# EAGLE board DLT_Jetson_Nano (EAGLE 9.4.2)
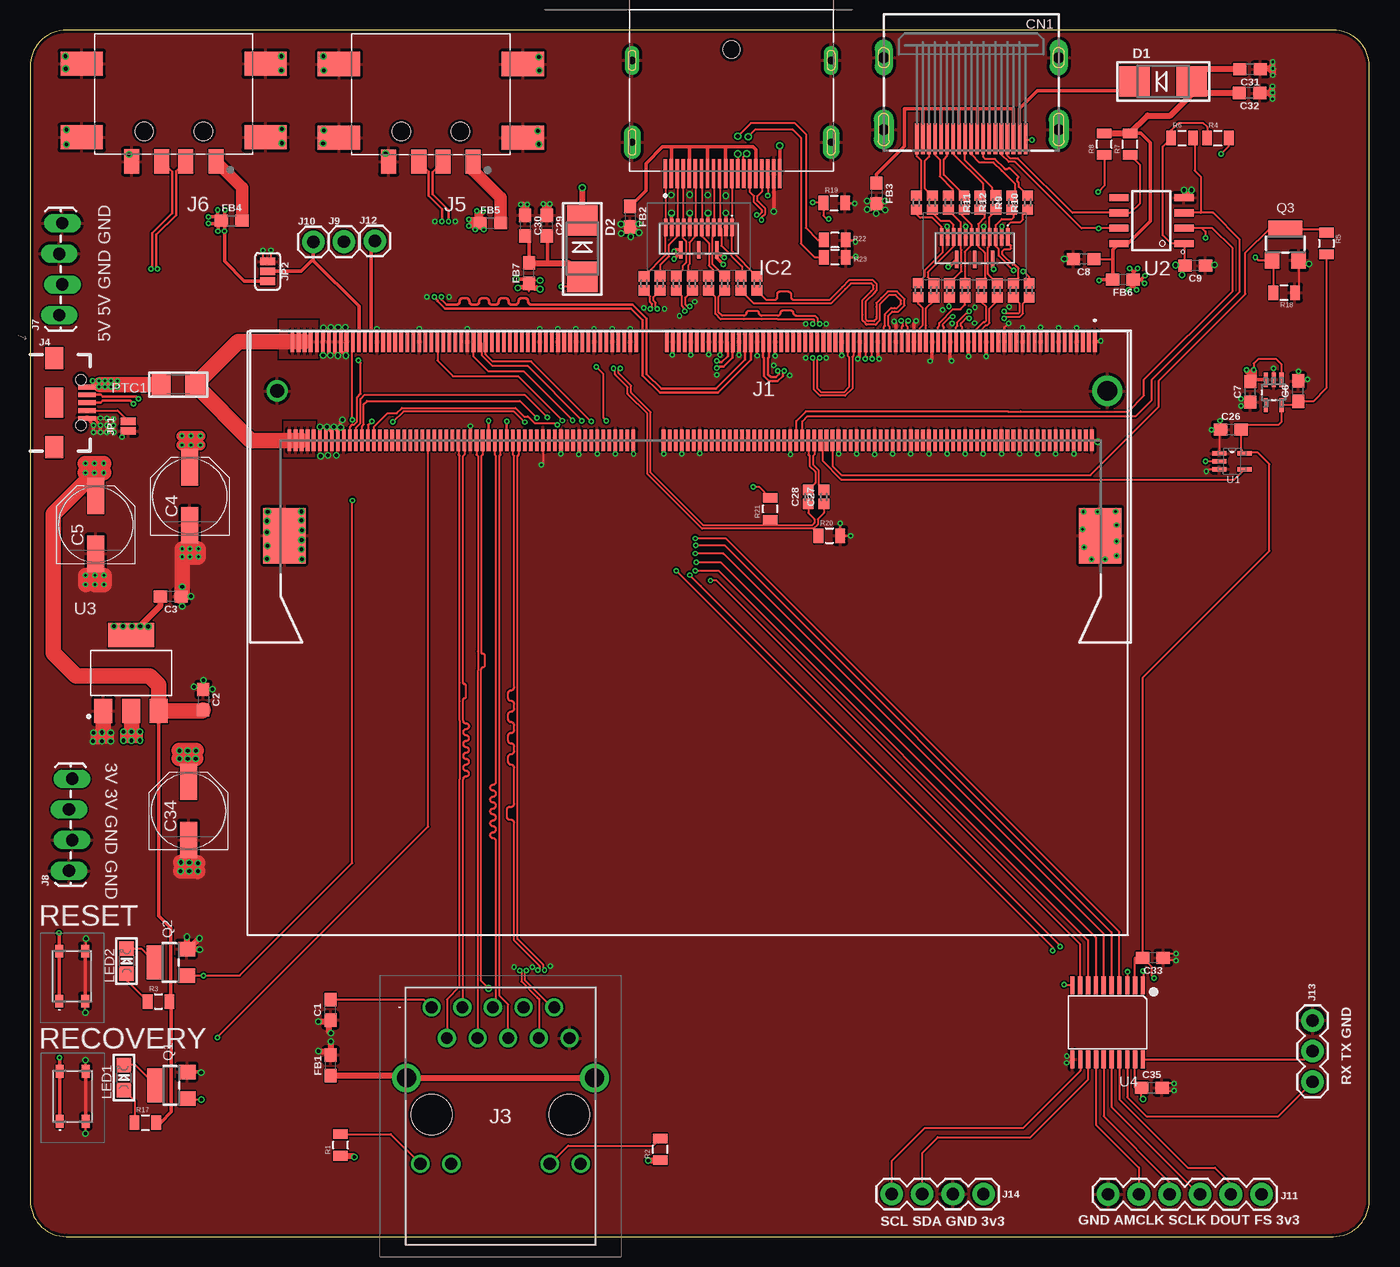
[diagram p2: board, top side]
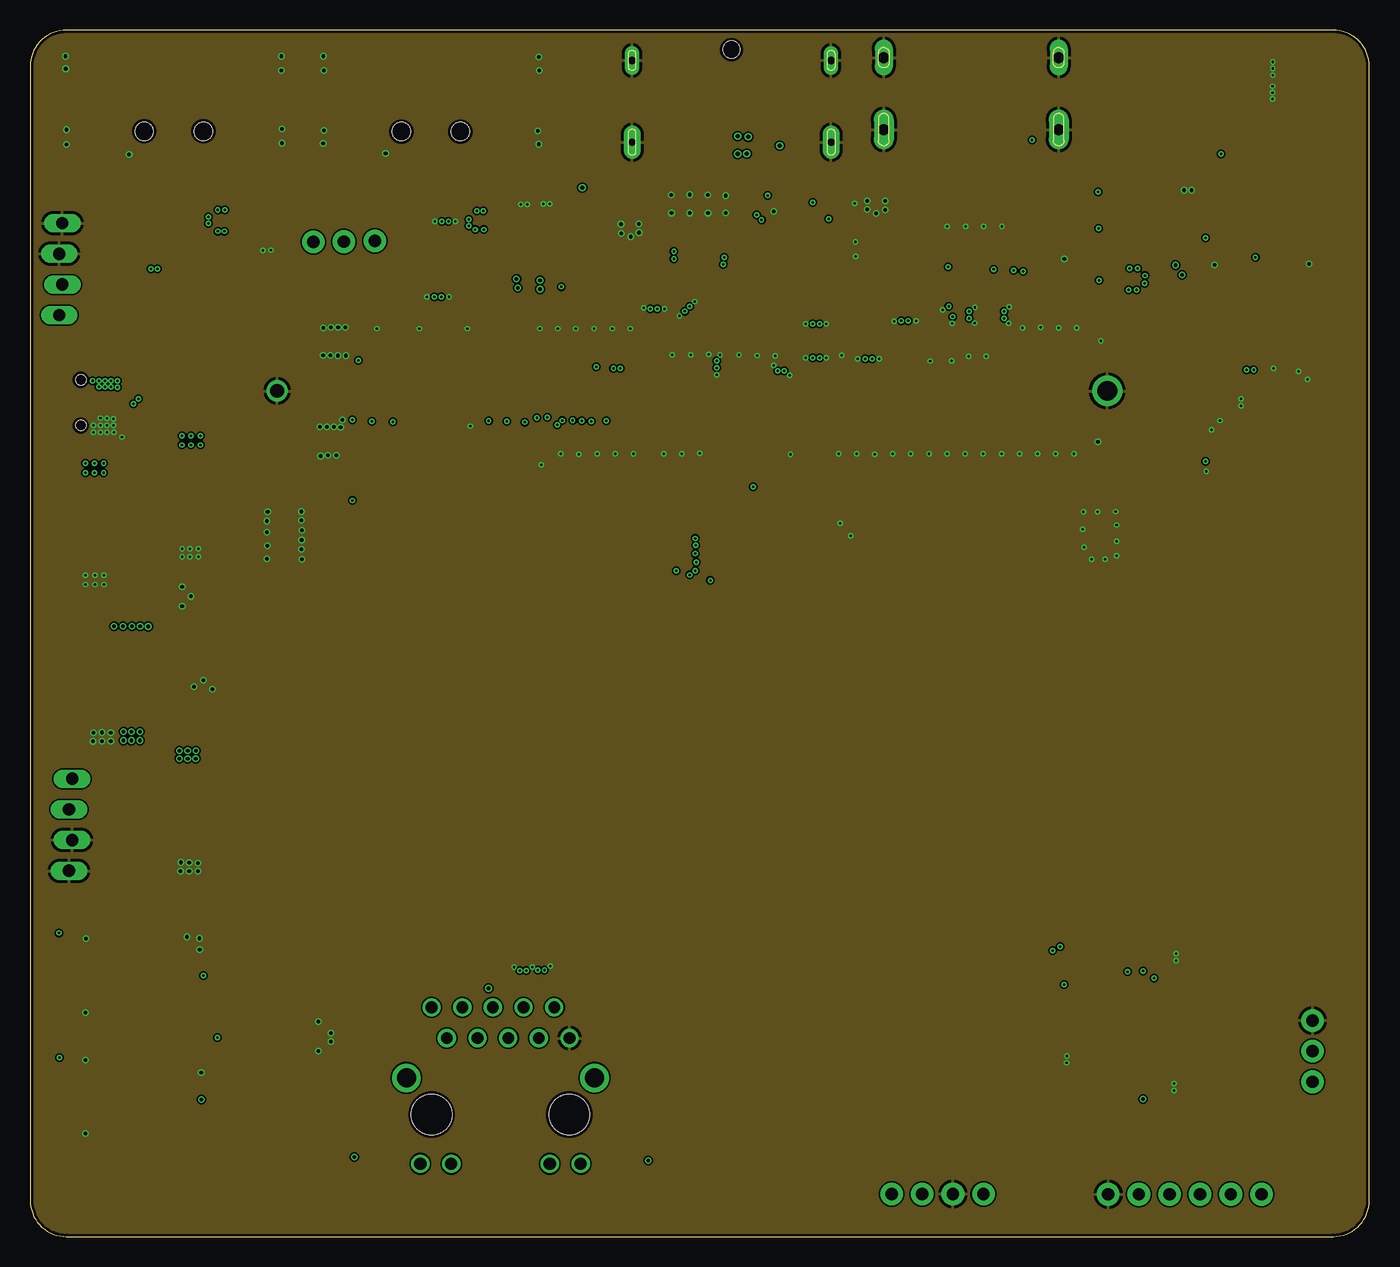
[diagram p3: board, inner layer Route2]
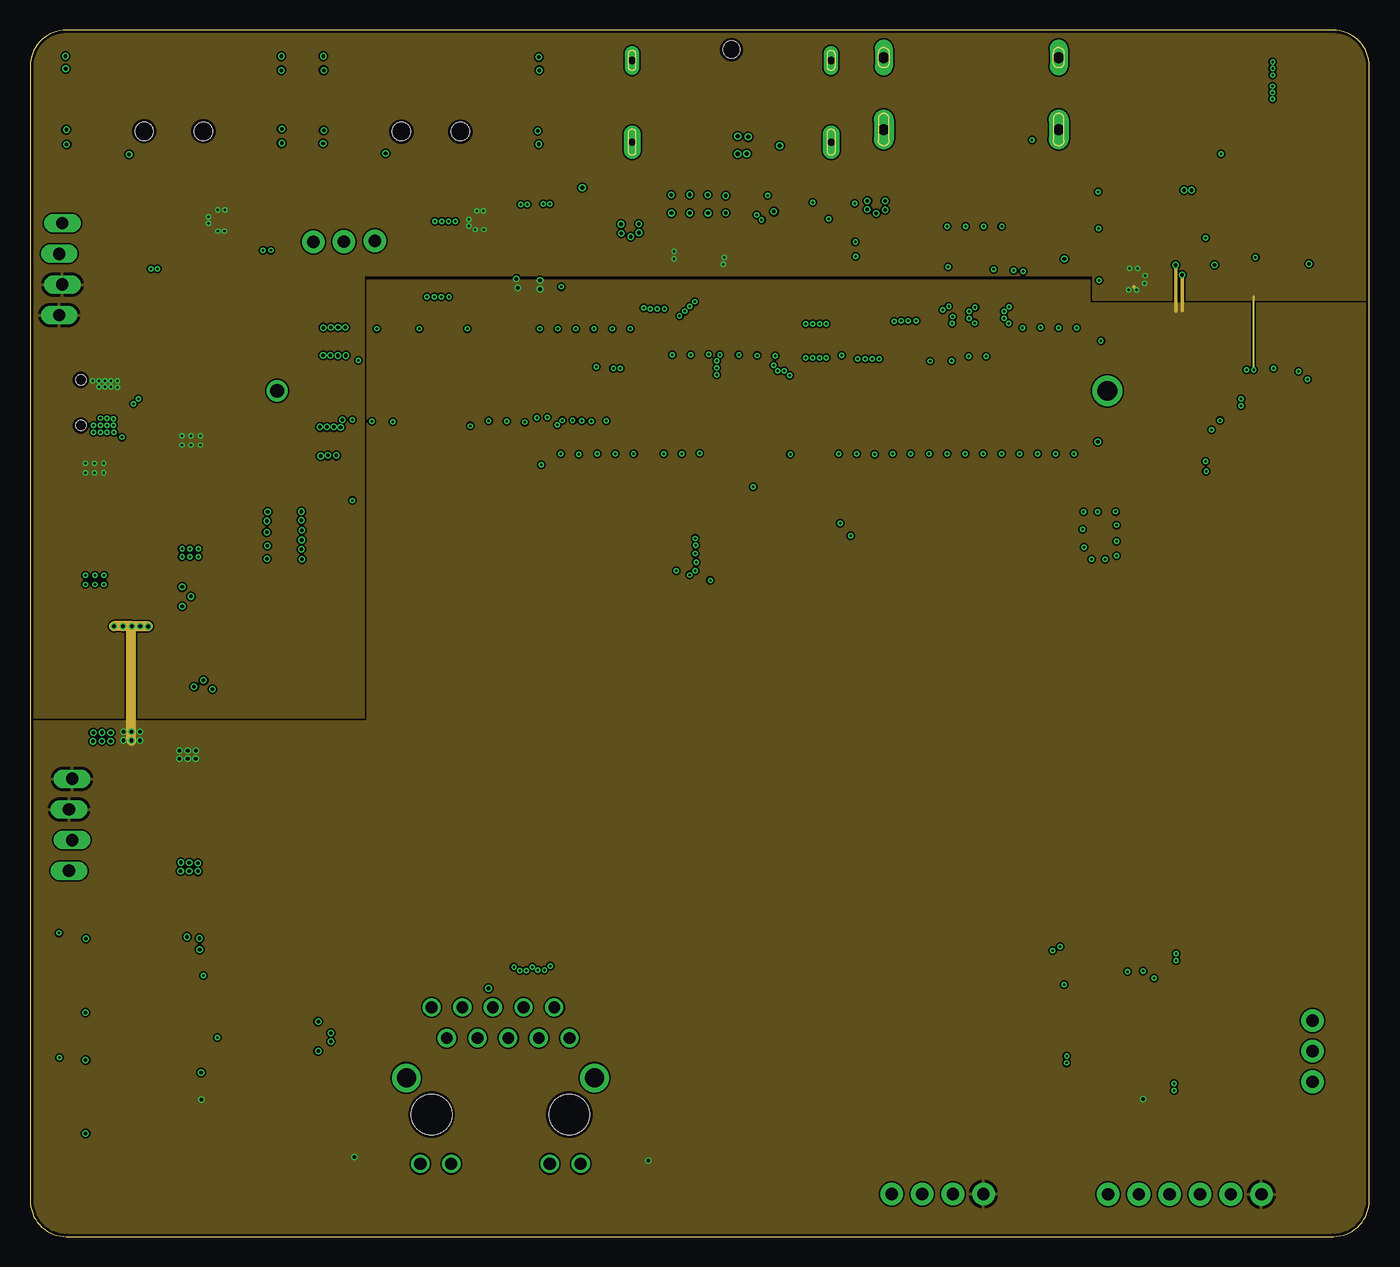
[diagram p4: board, inner layer Route15]
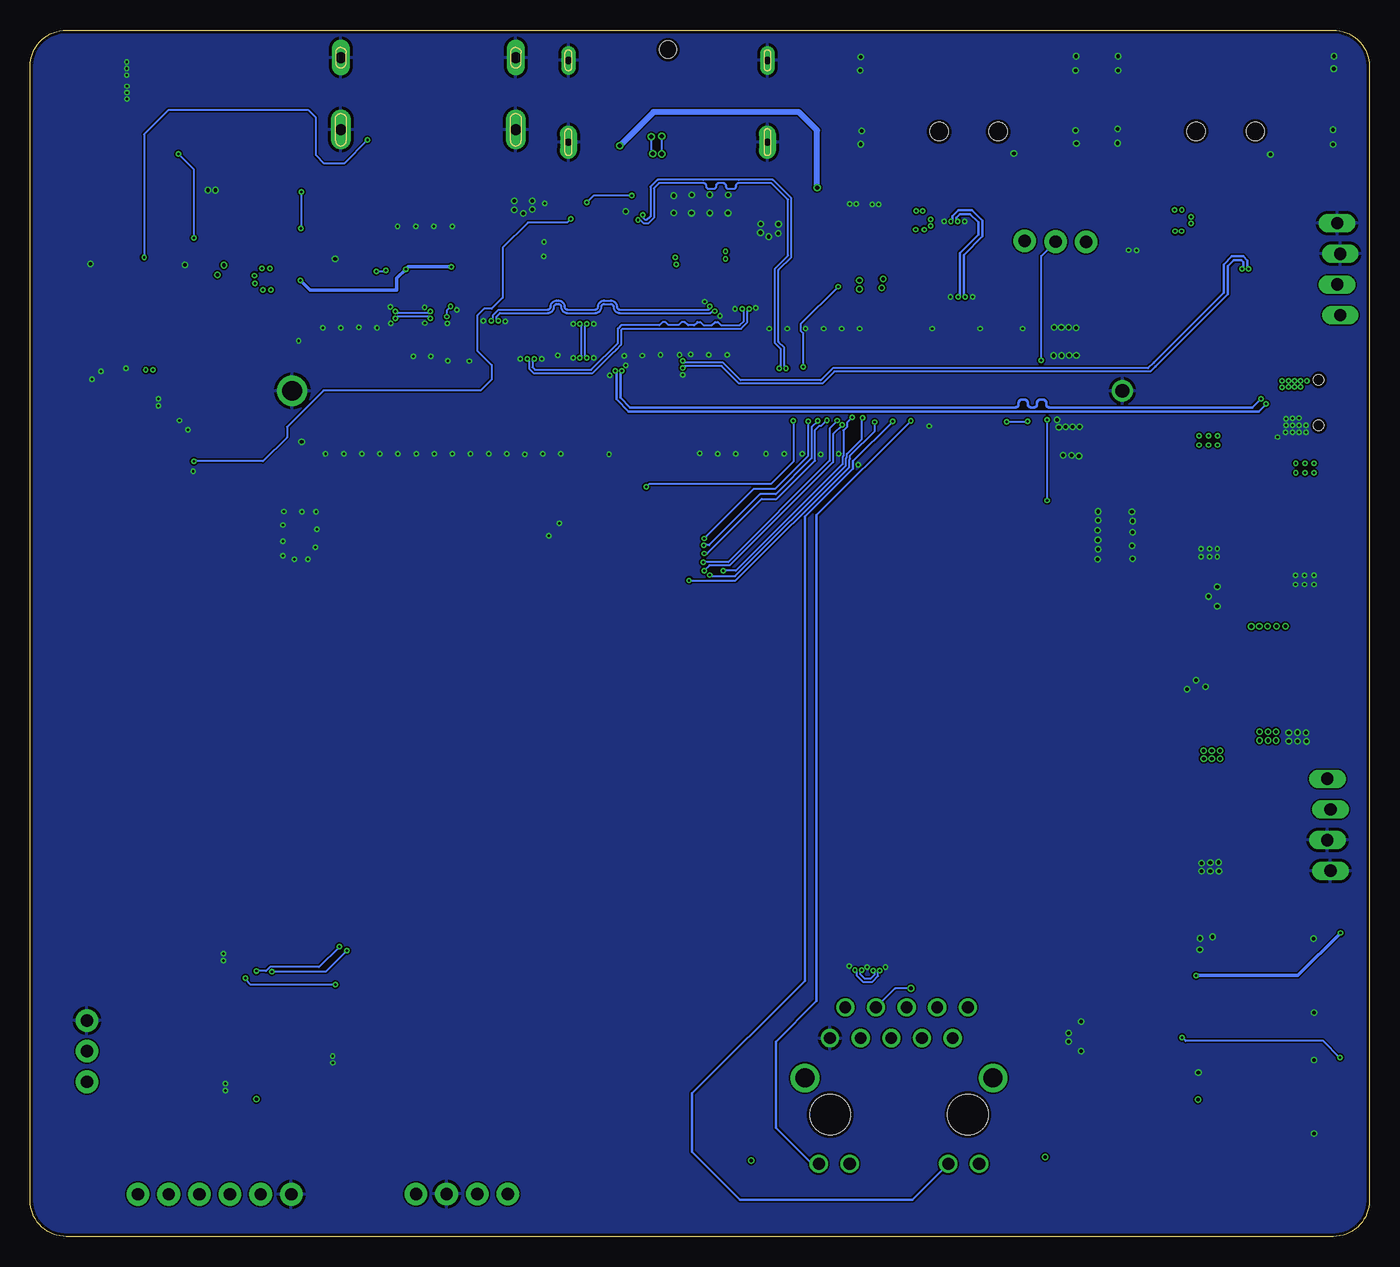
[diagram p5: board, bottom side, seen from below]

Size 111 x 100 mm. Coordinates in mm from the lower left corner, seen from the top.
Outline: 108,100 3,100 arc90 0,97 0,3 arc90 3,0 108,0 arc90 111,3 111,97 arc90 108,100
Copper layers (1+2*15+16): Top 0.035mm / dielectric 0.2mm / Route2 0.0175mm / dielectric 0.265mm / Route15 0.0175mm / dielectric 0.2mm / Bottom 0.035mm
Design rules "DLT-4Layer": minimum track width 6mil, minimum drill 0.2mm, track to track 5mil, track to pad 4mil, pad to pad 4mil, via to via 4mil, smd to smd 0mil, copper to edge 10mil, drill to drill 10mil, minimum pad ring 10mil, minimum via ring 0.125mm, stop-mask expansion 2mil, vias tented up to drill 100mil, thermal gap 10mil

## Footprints (pad centres in the part's own frame; a part is rotated, then mirrored left to right if it is on the bottom)
0603 = smd 1.1 x 1: 1 -0.85,0; 2 0.85,0
PANASONIC_D = smd 3 x 1.4: + 2.4,0; - -2.4,0
0402 = smd 0.85 x 0.9: 1 -0.58,0; 2 0.58,0
HDMI_MOLEX_47151-0001 = smd 0.3 x 2.6: 1 4.5,0; 2 4,0; 3 3.5,0; 4 3,0; 5 2.5,0; 6 2,0; 7 1.5,0; 8 1,0; 9 0.5,0; 10 0,0; 11 -0.5,0; 12 -1,0; 13 -1.5,0; 14 -2,0; 15 -2.5,0; 16 -3,0; 17 -3.5,0; 18 -4,0; 19 -4.5,0 | drill 0.9 pad 1.65 long: P$1 -7.25,-0.76; P$2 7.25,-0.76 | drill 0.9 pad 1.5 long: P$3 7.25,-6.72; P$4 -7.25,-6.72
SMADIODE = smd 2.54 x 2.54: A 2.349,0; C -2.349,0
TPD8S009DSMR = smd 0.3 x 1.45: 1 2.75,0.775; 2 2.25,0.775; 3 1.75,0.775; 4 1.25,0.775; 5 0.75,0.775; 6 0.25,0.775; 7 -0.25,0.775; 8 -0.75,0.775; 9 -1.25,0.775; 10 -1.75,0.775; 11 -2.25,0.775; 12 -2.75,0.775; 13 -1.5,-1.075; 14 0,-1.075; 15 1.5,-1.075
SOT65P210X110-5N = smd 1.168 x 0.356: 1 -1.041,0.66; 2 -1.041,0; 3 -1.041,-0.66; 4 1.041,-0.66; 5 1.041,0.66
2309409-1 = smd 0.3 x 1.75: 1 38.25,8.2; 2 38,0; 3 37.75,8.2; 4 37.5,0; 5 37.25,8.2; 6 37,0; 7 36.75,8.2; 8 36.5,0; 9 36.25,8.2; 10 36,0; 11 35.75,8.2; 12 35.5,0; 13 35.25,8.2; 14 35,0; 15 34.75,8.2; 16 34.5,0; 17 34.25,8.2; 18 34,0; 19 33.75,8.2; 20 33.5,0; 21 33.25,8.2; 22 33,0; 23 32.75,8.2; 24 32.5,0; 25 32.25,8.2; 26 32,0; 27 31.75,8.2; 28 31.5,0; 29 31.25,8.2; 30 31,0; 31 30.75,8.2; 32 30.5,0; 33 30.25,8.2; 34 30,0; 35 29.75,8.2; 36 29.5,0; 37 29.25,8.2; 38 29,0; 39 28.75,8.2; 40 28.5,0; 41 28.25,8.2; 42 28,0; 43 27.75,8.2; 44 27.5,0; 45 27.25,8.2; 46 27,0; 47 26.75,8.2; 48 26.5,0; 49 26.25,8.2; 50 26,0; 51 25.75,8.2; 52 25.5,0; 53 25.25,8.2; 54 25,0; 55 24.75,8.2; 56 24.5,0; 57 24.25,8.2; 58 24,0; 59 23.75,8.2; 60 23.5,0; 61 23.25,8.2; 62 23,0; 63 22.75,8.2; 64 22.5,0; 65 22.25,8.2; 66 22,0; 67 21.75,8.2; 68 21.5,0; 69 21.25,8.2; 70 21,0; 71 20.75,8.2; 72 20.5,0; 73 20.25,8.2; 74 20,0; 75 19.75,8.2; 76 19.5,0; 77 19.25,8.2; 78 19,0; 79 18.75,8.2; 80 18.5,0; 81 18.25,8.2; 82 18,0; 83 17.75,8.2; 84 17.5,0; 85 17.25,8.2; 86 17,0; 87 16.75,8.2; 88 16.5,0; 89 16.25,8.2; 90 16,0; 91 15.75,8.2; 92 15.5,0; 93 15.25,8.2; 94 15,0; 95 14.75,8.2; 96 14.5,0; 97 14.25,8.2; 98 14,0; 99 13.75,8.2; 100 13.5,0; 101 13.25,8.2; 102 13,0; 103 12.75,8.2; 104 12.5,0; 105 12.25,8.2; 106 12,0; 107 11.75,8.2; 108 11.5,0; 109 11.25,8.2; 110 11,0; 111 10.75,8.2; 112 10.5,0; 113 10.25,8.2; 114 10,0; 115 9.75,8.2; 116 9.5,0; 117 9.25,8.2; 118 9,0; 119 8.75,8.2; 120 8.5,0; 121 8.25,8.2; 122 8,0; 123 7.75,8.2; 124 7.5,0; 125 7.25,8.2; 126 7,0; 127 6.75,8.2; 128 6.5,0; 129 6.25,8.2; 130 6,0; 131 5.75,8.2; 132 5.5,0; 133 5.25,8.2; 134 5,0; 135 4.75,8.2; 136 4.5,0; 137 4.25,8.2; 138 4,0; 139 3.75,8.2; 140 3.5,0; 141 3.25,8.2; 142 3,0; 143 2.75,8.2; 144 2.5,0; 145 0.25,8.2; 146 0,0; 147 -0.25,8.2; 148 -0.5,0; 149 -0.75,8.2; 150 -1,0; 151 -1.25,8.2; 152 -1.5,0; 153 -1.75,8.2; 154 -2,0; 155 -2.25,8.2; 156 -2.5,0; 157 -2.75,8.2; 158 -3,0; 159 -3.25,8.2; 160 -3.5,0; 161 -3.75,8.2; 162 -4,0; 163 -4.25,8.2; 164 -4.5,0; 165 -4.75,8.2; 166 -5,0; 167 -5.25,8.2; 168 -5.5,0; 169 -5.75,8.2; 170 -6,0; 171 -6.25,8.2; 172 -6.5,0; 173 -6.75,8.2; 174 -7,0; 175 -7.25,8.2; 176 -7.5,0; 177 -7.75,8.2; 178 -8,0; 179 -8.25,8.2; 180 -8.5,0; 181 -8.75,8.2; 182 -9,0; 183 -9.25,8.2; 184 -9.5,0; 185 -9.75,8.2; 186 -10,0; 187 -10.25,8.2; 188 -10.5,0; 189 -10.75,8.2; 190 -11,0; 191 -11.25,8.2; 192 -11.5,0; 193 -11.75,8.2; 194 -12,0; 195 -12.25,8.2; 196 -12.5,0; 197 -12.75,8.2; 198 -13,0; 199 -13.25,8.2; 200 -13.5,0; 201 -13.75,8.2; 202 -14,0; 203 -14.25,8.2; 204 -14.5,0; 205 -14.75,8.2; 206 -15,0; 207 -15.25,8.2; 208 -15.5,0; 209 -15.75,8.2; 210 -16,0; 211 -16.25,8.2; 212 -16.5,0; 213 -16.75,8.2; 214 -17,0; 215 -17.25,8.2; 216 -17.5,0; 217 -17.75,8.2; 218 -18,0; 219 -18.25,8.2; 220 -18.5,0; 221 -18.75,8.2; 222 -19,0; 223 -19.25,8.2; 224 -19.5,0; 225 -19.75,8.2; 226 -20,0; 227 -20.25,8.2; 228 -20.5,0; 229 -20.75,8.2; 230 -21,0; 231 -21.25,8.2; 232 -21.5,0; 233 -21.75,8.2; 234 -22,0; 235 -22.25,8.2; 236 -22.5,0; 237 -22.75,8.2; 238 -23,0; 239 -23.25,8.2; 240 -23.5,0; 241 -23.75,8.2; 242 -24,0; 243 -24.25,8.2; 244 -24.5,0; 245 -24.75,8.2; 246 -25,0; 247 -25.25,8.2; 248 -25.5,0; 249 -25.75,8.2; 250 -26,0; 251 -26.25,8.2; 252 -26.5,0; 253 -26.75,8.2; 254 -27,0; 255 -27.25,8.2; 256 -27.5,0; 257 -27.75,8.2; 258 -28,0; 259 -28.25,8.2; 260 -28.5,0 | drill 1.65 pad 2.5: 261 39.275,4.1 | drill 1.15 pad 1.75: 262 -29.525,4.1 | smd 3.5 x 4.6: 263 38.675,-7.9; 264 -28.925,-7.9
MOLEX_47272-0001 = smd 0.28 x 2.4: 1 5.5,13.56; 2 5,13.56; 3 4.5,13.56; 4 4,13.56; 5 3.5,13.56; 6 3,13.56; 7 2.5,13.56; 8 2,13.56; 9 1.5,13.56; 10 1,13.56; 11 0.5,13.56; 12 0,13.56; 13 -0.5,13.56; 14 -1,13.56; 15 -1.5,13.56; 16 -2,13.56; 17 -2.5,13.56; 18 -3,13.56; 19 -3.5,13.56; 20 -4,13.56 | drill 0.6 pad 1.4 long: S1 -8.25,10.96; S2 8.25,10.96 | drill 0.6 pad 1.2 long: S3 -8.25,4.18; S4 8.25,4.18 | hole 1.4: 0,3.28
936263508 = drill 0.97 pad 1.509: 1 0,0; 2 1.27,-2.54; 3 2.54,0; 4 3.81,-2.54; 5 5.08,0; 6 6.35,-2.54; 7 7.62,0; 8 8.89,-2.54; 9 10.16,0; 10 11.43,-2.54 | drill 1.02 pad 1.53: 11 -0.92,-12.96; 12 1.62,-12.96; 13 9.81,-12.96; 14 12.35,-12.96 | drill 1.58 pad 2.37: MH1 -2.08,-5.84; MH2 13.51,-5.84 | hole 3.34: 0,-8.89; 11.43,-8.89
USB-B-MICRO-SMD = smd 1.45 x 0.4: D+ 2.725,0; D- 2.725,0.65; GND 2.725,-1.3; ID 2.725,-0.65; VBUS 2.725,1.3 | smd 1.5 x 1.8: SHIELD1 0,3.685; SHIELD2 0,-3.685 | smd 1.5 x 2.5: SHIELD3 0,0 | hole 0.85: 2.2,1.9; 2.2,-1.9
629104190121 = smd 1.25 x 2: 1 -3.5,2; 2 -1,2; 3 1,2; 4 3.5,2 | smd 3.5 x 2: SHELL -7.625,0; SHELL1 7.625,0; SHELL2 -7.625,-6.1; SHELL3 7.625,-6.1 | hole 1.5: -2.45,-0.5; 2.45,-0.5
1X04_LOCK_LONGPADS = drill 1.016 long: 1 0,0; 2 2.54,-0.254; 3 5.08,0; 4 7.62,-0.254
1X01 = drill 1.016 pad 1.88: 1 0,0
1X06 = drill 1.016 pad 1.88: 1 0,0; 2 2.54,0; 3 5.08,0; 4 7.62,0; 5 10.16,0; 6 12.7,0
1X03 = drill 1.016 pad 1.88: 1 0,0; 2 2.54,0; 3 5.08,0
1X04 = drill 1.016 pad 1.88: 1 0,0; 2 2.54,0; 3 5.08,0; 4 7.62,0
SMT-JUMPER_2_NC_PASTE_NO-SILK = smd 0.635 x 1.27: 1 -0.406,0; 2 0.406,0
SMT-JUMPER_3_1-NC_PASTE_SILK = smd 0.635 x 1.27: 1 -0.813,0; 2 0,0; 3 0.813,0
CHIPLED_0805 = smd 1.2 x 1.2: A 0,-1.05; C 0,1.05
1206 = smd 1.6 x 1.8: 1 -1.4,0; 2 1.4,0
SOT23-W = smd 1.2 x 1.4: 1 -1.1,-1.3; 2 1.1,-1.3 | smd 2.8 x 1.4: 3 0,1.3
0805 = smd 0.8 x 1.2: 1 -0.9,0; 2 0.9,0
SKRPADE010 = smd 1.05 x 0.65: 1 -1.95,1.075; 2 2.2,1.075; 3 -1.95,-1.075; 4 2.2,-1.075
SOIC127P600X175-8N = smd 1.6 x 0.6: 1 -2.7,1.905; 2 -2.7,0.635; 3 -2.7,-0.635; 4 -2.7,-1.905; 5 2.7,-1.905; 6 2.7,-0.635; 7 2.7,0.635; 8 2.7,1.905
SOT230P700X180-4N = smd 1.5 x 2: 1 -2.3,-3.15; 2 0,-3.15; 3 2.3,-3.15 | smd 3.8 x 2: 4 0,3.15
TSSOP20-0.65-6.5X4.4MM = smd 0.35 x 1.5: 1 -2.925,-3.065; 2 -2.275,-3.065; 3 -1.625,-3.065; 4 -0.975,-3.065; 5 -0.325,-3.065; 6 0.325,-3.065; 7 0.975,-3.065; 8 1.625,-3.065; 9 2.275,-3.065; 10 2.925,-3.065; 11 2.91,3.065; 12 2.26,3.065; 13 1.61,3.065; 14 0.96,3.065; 15 0.325,3.065; 16 -0.325,3.065; 17 -0.975,3.065; 18 -1.625,3.065; 19 -2.275,3.065; 20 -2.925,3.065

## Placement (x,y rotation side)
C1  10nF  [0603]  24.89,18.8 90 top
C2  1uF  [0603]  14.35,44.5 270 top
C3  4.7uF  [0603]  11.66,53.06 180 top
C4  [PANASONIC_D]  13.23,61.37 90 top
C5  [PANASONIC_D]  5.44,59 90 top
C6  1uF  [0603]  105.11,70.08 90 top
C7  4.7uF  [0603]  101.14,70.03 90 top
C8  0.1uF  [0603]  87.33,81.03 180 top
C9  0.1uF  [0603]  96.57,80.49 180 top
C10  0.1uF  [0402]  74.9,78.44 90 top
C11  0.1uF  [0402]  73.61,78.46 90 top
C12  0.1uF  [0402]  77.5,78.44 90 top
C13  0.1uF  [0402]  76.2,78.44 90 top
C14  0.1uF  [0402]  80.16,78.44 90 top
C15  0.1uF  [0402]  78.84,78.44 90 top
C16  0.1uF  [0402]  81.48,78.44 90 top
C17  0.1uF  [0402]  82.8,78.44 90 top
C18  0.1uF  [0402]  58.91,79.01 90 top
C19  0.1uF  [0402]  60.25,79.01 90 top
C20  0.1uF  [0402]  56.23,79.01 90 top
C21  0.1uF  [0402]  57.57,79.01 90 top
C22  0.1uF  [0402]  53.55,79.01 90 top
C23  0.1uF  [0402]  54.89,79.01 90 top
C24  0.1uF  [0402]  50.88,79.01 90 top
C25  0.1uF  [0402]  52.22,79.01 90 top
C26  0.1uF  [0603]  99.52,66.9 0 top
C27  0.1uF  [0402]  65.79,61.32 90 top
C28  0.1uF  [0402]  64.49,61.32 90 top
C29  4.7uF  [0603]  42.82,83.79 270 top
C30  4.7uF  [0603]  41.02,83.79 270 top
C31  4.7uF  [0603]  101.12,96.75 180 top
C32  4.7uF  [0603]  101.07,94.79 180 top
C33  0.1uF  [0603]  93.07,23.11 180 top
C34  [PANASONIC_D]  13.13,35.28 90 top
C35  0.1uF  [0603]  92.96,12.34 0 top
CN1  [HDMI_MOLEX_47151-0001]  78,91 180 top
D1  [SMADIODE]  93.9,95.76 0 top
D2  [SMADIODE]  45.77,81.89 270 top
FB1  .25/3A  [0603]  24.92,14.2 90 top
FB2  .25/3A  [0603]  49.71,84.53 270 top
FB3  .25/3A  [0603]  70.15,86.46 270 top
FB4  .25/3A  [0603]  16.71,84.2 0 top
FB5  .25/3A  [0603]  38.14,84.01 0 top
FB6  .25/3A  [0603]  90.58,79.32 180 top
FB7  .25/3A  [0603]  41.35,79.86 90 top
IC1  TPD8S009DSMR  [TPD8S009DSMR]  78.29,82.07 0 top
IC2  TPD8S009DSMR  [TPD8S009DSMR]  55.42,82.88 0 top
IC3  TLV70018DCKR  [SOT65P210X110-5N]  103.07,69.98 270 top
J1  2309409-1  [2309409-1]  50,66 0 top
J2  47272-0001  [MOLEX_47272-0001]  58.14,101.68 180 top
J3  93626-3508  [936263508]  33.27,18.99 0 top
J4  [USB-B-MICRO-SMD]  1.99,69.13 0 top
J5  [629104190121]  33.21,91.09 180 top
J6  [629104190121]  11.9,91.12 180 top
J7  [1X04_LOCK_LONGPADS]  2.41,76.38 90 top
J8  [1X04_LOCK_LONGPADS]  3.23,30.33 90 top
J9  [1X01]  26.01,82.47 0 top
J10  [1X01]  23.47,82.45 0 top
J11  [1X06]  102.06,3.51 180 top
J12  [1X01]  28.57,82.52 0 top
J13  [1X03]  106.3,17.91 270 top
J14  [1X04]  79.02,3.53 180 top
JP1  JUMPER-SMT_2_NC_PASTE_NO-SILK  [SMT-JUMPER_2_NC_PASTE_NO-SILK]  8.13,67.18 90 top
JP2  JUMPER-SMT_3_1-NC_PASTE_SILK  [SMT-JUMPER_3_1-NC_PASTE_SILK]  19.68,80.01 270 top
LED1  [CHIPLED_0805]  7.77,13.18 0 top
LED2  [CHIPLED_0805]  8,22.83 0 top
PTC1  [1206]  12.27,70.61 180 top
Q1  [SOT23-W]  11.71,12.55 90 top
Q2  [SOT23-W]  11.66,22.73 90 top
Q3  [SOT23-W]  104.04,82.22 0 top
R1  220  [0805]  25.73,7.59 90 top
R2  220  [0805]  52.22,7.24 90 top
R3  [0805]  10.64,19.48 0 top
R4  10k  [0805]  98.45,91.06 0 top
R5  4.7k  [0805]  107.44,82.32 270 top
R6  10k  [0805]  95.48,91.06 0 top
R7  10k  [0805]  91.16,90.55 90 top
R8  10k  [0805]  89.03,90.55 90 top
R9  5.6  [0402]  81.36,85.7 90 top
R10  5.6  [0402]  82.68,85.7 90 top
R11  5.6  [0402]  78.71,85.7 90 top
R12  5.6  [0402]  80.04,85.72 90 top
R13  5.6  [0402]  76.1,85.7 90 top
R14  5.6  [0402]  77.42,85.7 90 top
R15  5.6  [0402]  73.46,85.7 90 top
R16  5.6  [0402]  74.78,85.7 90 top
R17  [0805]  9.55,9.45 0 top
R18  4.7k  [0805]  103.94,78.23 180 top
R19  100k  [0805]  66.65,85.67 0 top
R20  100k  [0805]  66.24,58.09 0 top
R21  100k  [0805]  61.34,60.33 90 top
R22  1M  [0805]  66.7,82.6 180 top
R23  1M  [0805]  66.7,81.18 180 top
S2  SKRPADE010  [SKRPADE010]  3.48,21.46 90 top
S4  SKRPADE010  [SKRPADE010]  3.53,11.5 90 top
U1  SN74LV1T125DCKR  [SOT65P210X110-5N]  99.62,64.26 0 top
U2  PCA9517AD,118  [SOIC127P600X175-8N]  92.94,84.22 180 top
U3  LDL1117S12R  [SOT230P700X180-4N]  8.36,46.72 0 top
U4  TXS0108EPWR-TSSOP20  [TSSOP20-0.65-6.5X4.4MM]  89.31,17.75 180 top

## Tracks (layer width: path | path; a pad name or v marks a point on that pad's centre or on a via)
1.8V  (via drill 0.2)
  Top 0.152: U1.5 100.6,64.99 | 100.6,64.99 100.37,65.22 C26.2 100.77,67.31 103.5,67.31 103.73,67.54 IC3.5 104.81,68.94 C6.1 106.34,69.23 107.44,70.33 R5.2 | 86.38,20.99 U4.10 85.76,20.82 v85.7,20.88 | U4.2 91.58,23.11 C33.2 | v93.14,21.44 92.96,21.61 92.96,22.37 C33.2 | C33.2 92.22,46.34 102.72,56.84 102.72,64.03 101.77,64.99 100.6,64.99
  Bottom 0.152: v85.7,20.88 92.71,20.88 93.14,21.31 v93.14,21.44
3.3V  (via drill 0.3)
  Top 0.152: C9.2 95.72,82.23 U2.1 94.57,82.31 93.88,83.01 93.88,90.36 R6.1 94.58,91.71 95.2,92.33 97.21,92.33 97.55,91.98 R4.1 | v14.2,11.35 13.1,11.35 Q1.1 | FB7.1 41.59,79.25 v42.27,79.25 | FB7.1 41.37,78.99 41.37,78.79 42.01,78.79 v42.27,78.54 | 41.35,78.36 41.35,78.82 | 41.35,78.82 41.35,78.92 FB7.1 | v40.41,78.64 40.59,78.82 41.35,78.82 | U4.19 91.58,12.34 C35.1 92.11,11.54 v92.25,11.4
  Top 0.203: U3.4 8.36,50.52 v8.43,50.6
  Top 0.206: 52.07,6.34 R2.1
  Top 0.305: v95.48,79.7 95.48,80.25 C9.2 95.69,80.52 v94.94,80.52 | v42.27,78.54 41.82,78.54 41.37,78.99 | 41.33,78.89 40.84,79.38 v40.31,79.38 | v40.41,78.64 41.07,78.64 41.33,78.89 | 41.33,78.89 41.35,78.92
  Top 0.508: U3.4 10.81,52.31 C3.2 | R1.1 26.78,6.7 v26.87,6.6 | v51.23,6.3 51.27,6.34 52.07,6.34 | v8.41,41.86 v9.09,41.86 v9.09,41.12 v8.38,41.12 v7.72,41.12 7.72,41.83 v7.75,41.86 v8.41,41.86
  Top 1.27: U3.2 8.41,43.52 v8.41,41.86 | C34.+ 13.13,40.21 v13.06,40.28 | v13.06,40.28 v12.37,40.28 | v12.37,39.62 v13.06,39.62 v13.72,39.62 | v13.06,40.28 v13.74,40.28
  Route15 0.305: v95.48,79.7 95.48,76.73 | v94.94,80.52 94.94,76.71
  Route15 0.813: v8.38,41.12 8.38,50.55 v8.43,50.6 | v8.43,50.6 v9.12,50.6 9.75,50.6 v9.78,50.57 | v8.43,50.6 v7.7,50.6 v6.96,50.6
  pour Route15: -3.53,-2.62 -3.53,42.75 27.99,42.75 27.99,79.27 87.78,79.27 87.78,77.39 113.84,77.39 113.84,-2.62
5V  (via drill 0.2)
  Top 0.152: IC3.1 103.73,72.29 103.3,72.72 101.78,72.72 101.42,72.36 v101.42,71.83
  Top 0.305: v14.78,83.97 15.63,83.97 FB4.1 | v14.78,84.53 15.52,84.53 15.54,84.51 | v16.13,85.11 16.13,84.47 15.99,84.34 | 15.99,84.34 FB4.1 | v15.54,85.11 15.54,84.51 | 15.54,84.51 15.7,84.36 | 15.7,84.36 FB4.1 | v15.57,83.34 15.57,84.23 15.7,84.36 | v16.1,83.34 16.1,83.49 | 16.1,83.49 16.1,84.23 15.99,84.34 | J4.VBUS 5.18,70.43 | 5.18,70.43 v5.69,70.43 | v5.69,70.43 v6.2,70.43 | v6.2,70.43 v6.71,70.43 | v6.71,70.43 7.21,70.43 v7.24,70.41 7.24,70.89 | 7.24,70.89 v7.24,70.94 | v6.71,70.43 v6.71,70.94 | v6.2,70.43 v6.2,70.92 | v5.69,70.43 v5.69,70.94 | 5.18,70.43 v5.18,70.94 v5.69,70.94 | v5.69,70.94 5.71,70.92 v6.2,70.92 | v6.2,70.92 6.68,70.92 v6.71,70.94 | v6.71,70.94 6.76,70.89 7.24,70.89 | v53.37,81.66 53.51,81.81 IC2.13 53.92,81.58 v53.37,81.03 | IC2.15 56.92,81.66 | 56.92,81.66 56.92,81.1 57.43,80.59 v57.45,80.59 | v57.53,81.18 57.41,81.18 56.92,81.66 | v91.72,78.49 91.43,78.78 FB6.1 | v91.03,78.49 91.05,78.49 91.43,78.87 FB6.1 | FB6.1 92.05,79.32 v92.38,78.99 | v92.41,79.65 92.08,79.32 FB6.1 | v91.8,80.26 91.43,79.89 | 91.43,79.89 FB6.1 | v91.14,80.26 91.43,79.97 91.43,79.89 | C7.2 101.28,71.02 IC3.3 | U3.3 10.66,26.57 11.63,25.6 11.63,19.57 R3.2 11.71,19.32 11.71,10.34 10.82,9.45 R17.2 | JP2.3 17.75,79.2 16.1,80.85 16.1,83.49
  Top 0.508: v100.81,71.83 101.14,71.5 C7.2 101.42,71.16 v101.42,71.83 | 6.24,70.61 6.2,70.56 v6.2,70.43 | v36.88,83.46 36.88,83.6 FB5.1 | v36.37,83.77 36.61,84.01 FB5.1 | v36.37,84.3 37,84.3 FB5.1 | v37.03,85.01 37.03,84.27 FB5.1 | v37.57,85.01 37.29,84.74 FB5.1 | v37.62,83.46 37.29,83.79 FB5.1
  Top 0.864: C4.+ 13.34,63.87 v13.34,66.37 | v13.34,66.37 v14.1,66.37 | v13.34,66.37 v12.57,66.37 | v12.57,65.61 v13.34,65.61 v14.1,65.61
  Top 1.27: PTC1.2 6.24,70.61 6.21,70.64 5.82,70.64 | C5.+ 5.33,61.51 v5.33,64.08 | v5.33,64.08 v6.1,64.08 | v5.33,63.32 v6.1,63.32 | v5.33,63.32 v4.57,63.32 | v5.33,64.08 v4.57,64.08 | C2.2 14.27,43.57 U3.3 10.66,45.73 9.91,46.48 3.81,46.48 1.91,48.39 1.91,59.89 v5.33,63.32
  Route15 0.152: v101.42,71.83 101.42,77.93 101.4,77.95
  Route15 0.305: v91.72,78.49 91.47,78.74
  pour Route15: -3.61,43.03 27.69,43.03 27.69,45.77 27.69,79.68 42.04,79.68 88.09,79.68 88.09,77.67 113.89,77.67 113.89,102.62 2.29,102.62 -3.61,102.62
#PWR_BUTTON  (via drill 0.2)
  Top 0.152: J1.240 26.5,67.11 26.7,67.31 26.86,67.31 27.1,67.55 27.1,69.56 27.41,69.86 27.41,72.44 v27.2,72.64
  Bottom 0.152: v27.2,72.64 27.2,81.28 J9.1
#RECOVERY  (via drill 0.2)
  Top 0.152: v15.52,16.51 33,33.99 J1.214
  Top 0.305: S4.1 S4.2 2.45,14.82 v2.44,14.83
  Bottom 0.152: v2.44,14.83 3.81,16.2 15.21,16.2 v15.52,16.51
#RESET  (via drill 0.2)
  Top 0.152: Q2.1 v14.38,21.63 17.37,21.63 26.7,30.96 v26.7,61.01 | v26.7,67.72 26.7,74.14 J1.239
  Top 0.305: S2.1 S2.2 2.4,25.16 v2.39,25.17
  Bottom 0.152: v26.7,61.01 v26.7,67.72
  Bottom 0.305: v2.39,25.17 5.93,21.63 v14.38,21.63
#SHUTDOWN_REQ
  Top 0.305: J1.233 28.25,82.2 J12.1
AUD_MCLK  (via drill 0.2)
  Top 0.152: J1.211 33.75,72.62 35.05,71.32 40.44,71.32 v44.12,67.64 | v55.22,55.91 57.23,55.91 88.33,24.8 U4.7
  Bottom 0.152: v44.12,67.64 44.12,67.59 44.73,66.98 44.73,64.31 53.14,55.91 v55.22,55.91
AUD_MCLK_3V
  Top 0.152: U4.14 88.35,9.27 91.9,5.71 J11.5
CONFIG1  (via drill 0.35)
  Top 0.152: R22.2 65.3,82.6 64.29,83.62 64.29,91.39 63.37,92.3 59.74,92.3 v58.65,91.21 | v58.65,89.74 J2.13
  Bottom 0.152: v58.65,91.21 v58.65,89.74
CONFIG2  (via drill 0.35)
  Top 0.152: 60.78,91.77 60.96,91.77 | 60.96,91.77 63.2,91.77 63.22,91.75 63.88,91.08 63.88,82.32 65.02,81.18 R23.2 | J2.14 59.14,89.52 v59.38,89.77 | v59.51,91.16 60.12,91.77 60.96,91.77
  Bottom 0.152: v59.38,89.77 59.51,89.89 v59.51,91.16
DAP4_DOUT  (via drill 0.2)
  Top 0.152: J1.197 37.42,74.03 37.42,73.05 38.29,72.19 41.22,72.19 45.72,67.69 v45.72,67.61 | v55.17,57.31 57.55,57.31 89.63,25.23 U4.5
  Bottom 0.152: v45.72,67.61 46.23,67.11 46.23,64.51 49.2,61.54 50.49,61.54 54.73,57.31 v55.17,57.31
DAP4_DOUT_3V
  Top 0.152: U4.16 89.63,10.75 96.88,3.5 J11.3
DAP4_FS  (via drill 0.2)
  Top 0.152: U4.4 90.28,25.24 57.66,57.86 v55.14,57.86 | v46.51,67.56 41.53,72.54 38.33,72.54 37.75,73.12 J1.195
  Bottom 0.152: v55.14,57.86 51,62 49.24,62 46.51,64.73 v46.51,67.56
DAP4_FS_3V
  Top 0.152: U4.17 90.28,11.37 95.94,5.71 98.2,5.71 99.52,4.39 J11.2
DAP4_SCLK  (via drill 0.2)
  Top 0.152: U4.6 88.98,25.09 57.45,56.62 v55.14,56.62 | v44.96,67.67 40.92,71.7 38,71.7 36.75,72.95 J1.199
  Bottom 0.152: v55.14,56.62 54.89,56.62 50.37,61.14 49.12,61.14 45.95,64.31 45.95,66.85 45.59,67.21 45.41,67.21 v44.96,67.67
DAP4_SCLK_3V
  Top 0.152: U4.15 88.98,9.98 94.44,4.52 J11.4
DP_GND
  Top 0.152: 54.66,88.12 J2.5
  Top 0.305: J2.2 53.14,90.32 | 54.66,90.32 53.14,90.32 | 54.66,90.32 54.66,88.12 | 54.66,90.32 56.14,90.32 | 56.14,90.32 J2.8 | 56.14,90.32 57.64,90.32 | 57.64,90.32 57.64,89.99 J2.11 | 53.14,90.32 52.4,90.32 51.03,88.95 51.03,86.7 FB2.1 | J2.16 60.14,90.09 | 60.14,90.09 60.15,90.09 | 57.64,90.32 59.91,90.32 60.14,90.09
DP_HPD_IN  (via drill 0.2)
  Top 0.152: J2.18 v61.14,86.29 v61.14,86.28 | v64.85,85.72 65.7,85.72 R19.1 65.75,84.64 66.04,84.35 v66.19,84.35 | v97.41,64.26 U1.2
  Bottom 0.152: v61.14,86.28 64.29,86.28 v64.85,85.72 | v66.19,84.35 66.5,84.05 69.75,84.05 71.83,81.97 71.83,77.83 72.75,76.91 73.38,76.91 73.94,76.35 73.94,73.43 72.75,72.24 72.75,71.04 73.66,70.13 86.69,70.13 89.71,67.11 89.71,66.24 91.69,64.26 v97.41,64.26
DP_PWR  (via drill 0.2)
  Top 0.152: D2.A 44.97,78.74 v44.02,78.74 | v46.94,72.08 47.5,71.53 47.5,67.87 v47.75,67.61 | v59.92,62.15 60.41,62.15 R21.2
  Top 0.305: C30.2 41.35,82.61 FB7.2 | C29.2 42.9,82.87 42.9,80.71
  Top 0.508: FB7.2 42.9,80.71 44.6,80.71 D2.A
  Bottom 0.152: v46.94,72.08 46.94,74.89 47.14,75.09 47.14,75.62 v44.02,78.74 | v47.75,67.61 47.75,64.24 49.61,62.38 59.69,62.38 v59.92,62.15
EDP0_TX_C_N
  Top 0.152: IC2.10 53.67,83.82 | J2.3 53.67,88.09 53.67,83.82 | C25.2 52.22,80.53 52.95,81.27 52.95,82.21 53.67,82.93 53.67,83.82
EDP0_TX_C_P
  Top 0.152: J2.1 52.67,88.09 IC2.12 52.67,81.38 C24.2
EDP0_TX_N  (via drill 0.2)
  Top 0.152: J1.77 69.25,73.02 69.36,72.91 69.36,72.75 v69.21,72.75 | v51.99,76.89 51.84,77.03 51.84,77.41 51.66,77.59 51.66,77.88 C25.1
  Bottom 0.152: v69.21,72.75 69.36,72.6 69.36,72.05 69.16,71.86 64.49,71.86 62.28,74.07 62.28,75.27 62.02,75.54 58.85,75.54 58.6,75.79 58.32,75.79 58.09,75.56 57.25,75.56 57,75.82 56.74,75.82 56.46,75.54 55.98,75.54 55.7,75.82 55.45,75.82 55.17,75.54 54.51,75.54 54.23,75.82 54,75.82 53.72,75.54 52.2,75.54 51.84,75.89 51.84,76.74 v51.99,76.89
EDP0_TX_P  (via drill 0.2)
  Top 0.152: J1.75 69.75,73.02 69.64,72.91 69.64,72.75 v69.79,72.75 | v51.41,76.89 51.56,77.03 51.56,77.29 51.38,77.47 51.38,77.92 C24.1
  Bottom 0.152: v69.79,72.75 69.64,72.6 69.64,71.94 69.28,71.58 64.38,71.58 62.82,73.13 62.41,73.54 62.01,73.94 62,73.95 62,75.16 61.9,75.26 52.08,75.26 51.56,75.78 51.56,76.74 v51.41,76.89
EDP1_TX_C_N
  Top 0.152: J2.6 55.17,88.09 55.17,83.8 | 55.17,83.8 IC2.7 | 55.17,83.8 55.17,82.93 54.63,82.4 54.63,80.59 54.53,80.49 54.53,80.02 54.89,79.66 C23.2
EDP1_TX_C_P
  Top 0.152: C22.2 54.09,80.12 54.09,80.45 54.36,80.72 54.36,82.52 54.09,82.78 54.09,83.57 IC2.9 54.17,88.08 J2.4
EDP1_TX_N  (via drill 0.2)
  Top 0.152: J1.63 72.75,75.38 72.64,75.49 72.64,75.92 v72.79,75.92 | v54.66,77.12 54.45,77.12 54.3,77.27 54.3,77.84 C23.1
  Bottom 0.152: v72.79,75.92 72.64,76.07 72.64,76.37 72.17,76.83 68.1,76.83 arc-90 67.86,77.07 arc90 67.35,77.58 67.22,77.58 arc90 66.71,77.07 arc-90 66.47,76.83 64.17,76.83 arc-90 63.93,77.07 arc90 63.42,77.58 62.88,77.58 arc90 62.36,77.07 arc-90 62.13,76.83 54.74,76.83 54.61,76.96 54.61,77.06 v54.66,77.12
EDP1_TX_P  (via drill 0.2)
  Top 0.152: J1.65 72.25,75.38 72.36,75.49 72.36,75.92 v72.21,75.92 | v54.26,76.71 54.26,76.92 54.03,77.15 54.03,77.95 C22.1
  Bottom 0.152: v72.21,75.92 72.36,76.07 72.36,76.25 72.06,76.56 68.1,76.56 arc-90 67.58,77.07 arc90 67.35,77.31 67.22,77.31 arc90 66.99,77.07 arc-90 66.47,76.56 64.17,76.56 arc-90 63.65,77.07 arc90 63.42,77.31 62.88,77.31 arc90 62.64,77.07 arc-90 62.13,76.56 54.62,76.56 54.41,76.76 54.31,76.76 v54.26,76.71
EDP2_TX_C_N
  Top 0.152: J2.9 56.69,88.06 56.69,83.87 | 56.69,83.87 56.69,83.67 IC2.4 | C21.2 56.54,80.62 56.54,82.8 56.69,82.95 56.69,83.87
EDP2_TX_C_P
  Top 0.152: J2.7 55.67,88.08 IC2.6 55.67,82.91 56.26,82.33 56.26,80.5 56.61,80.14 56.61,79.87 56.33,79.59 C20.2
EDP2_TX_N  (via drill 0.2)
  Top 0.152: v65.43,75.67 65.28,75.81 65.28,76.09 65.04,76.33 63.5,76.33 arc-90 63.27,76.56 arc90 63.08,76.75 62.37,76.75 arc90 62.19,76.56 arc-90 61.95,76.33 60.64,76.33 arc-90 60.41,76.56 arc90 60.25,76.72 59.52,76.72 arc90 59.37,76.56 arc-90 59.13,76.33 57.35,76.33 57.07,76.61 57.07,77.93 C21.1 | J1.83 67.75,73.02 67.86,72.91 67.86,70.4 67.44,69.98 65.58,69.98 65.25,70.31 65.25,72.67 v65.43,72.85
  Bottom 0.152: v65.43,72.85 65.28,73 65.28,75.52 v65.43,75.67
EDP2_TX_P  (via drill 0.2)
  Top 0.152: v64.85,75.67 65,75.81 65,75.97 64.92,76.05 63.5,76.05 61.95,76.05 60.64,76.05 59.13,76.05 57.24,76.05 56.79,76.49 56.79,77.86 C20.1 | J1.81 68.25,73.02 68.14,72.91 68.14,70.28 67.55,69.7 65.47,69.7 64.97,70.19 64.97,72.72 v64.85,72.85
  Bottom 0.152: v64.85,72.85 65,73 65,75.52 v64.85,75.67
EDP3_TX_C_N
  Top 0.152: J2.12 58.19,88.06 58.19,83.67 IC2.1 58.17,81.66 C19.2
EDP3_TX_C_P
  Top 0.152: J2.10 57.17,88.08 IC2.3 57.3,83.53 57.3,82.12 59,80.42 59,79.59 C18.2
EDP3_TX_N
  Top 0.152: J1.69 71.25,75.38 71.14,75.49 71.14,76.35 71.47,76.68 71.65,76.68 71.97,76.68 72.38,77.09 72.47,77.18 72.47,77.71 72.26,77.92 71.84,78.33 71.55,78.33 71.08,78.33 70.54,77.8 70.13,77.38 70.13,77.06 70.13,76.25 70.13,76.05 69.95,75.87 69.44,75.87 69.42,75.89 69.27,76.05 69.27,76.4 69.27,77.52 69.39,77.65 69.93,78.18 70.18,78.44 70.18,78.84 70.18,78.96 69.86,79.27 67.87,79.27 67.87,79.26 67.31,78.7 67.31,78.69 66.24,77.62 63.32,77.62 arc-90 63.09,77.86 63.09,78.08 arc90 62.85,78.31 62.14,78.31 arc90 61.91,78.08 61.91,77.86 arc-90 61.67,77.62 61.04,77.62 60.25,78.41 C19.1
EDP3_TX_P
  Top 0.152: J1.71 70.75,75.38 70.86,75.49 70.86,76.35 70.86,76.47 71.35,76.96 71.65,76.96 71.86,76.96 72.19,77.29 72.19,77.6 72.06,77.72 71.73,78.05 71.55,78.05 71.2,78.05 70.74,77.6 70.41,77.27 70.41,77.06 70.41,76.25 70.41,75.93 70.15,75.67 70.07,75.59 69.33,75.59 69.22,75.7 68.99,75.93 68.99,76.4 68.99,77.64 69.19,77.84 69.73,78.38 69.9,78.55 69.9,78.84 69.75,78.99 68.02,78.99 67.56,78.54 67.56,78.55 66.36,77.34 63.32,77.34 61.67,77.34 59.99,77.34 C18.1
EDP_AUX_C_N  (via drill 0.2)
  Top 0.152: J2.17 60.64,86.61 60.28,86.25 60.28,85.85 60.29,85.85 60.95,85.19 60.95,84.81 60.62,84.48 v60.62,84.29 | C28.1 64.49,59.98 65,59.47 65,59.16 64.8,58.95 61.37,58.95 | 61.37,58.95 55.8,58.95 51.44,63.32 51.44,68.34 49.81,69.97 49.81,70.53 48.77,71.57 48.77,71.98 v48.9,71.98 | R21.1 61.37,59.4 61.37,58.95
  Bottom 0.152: v48.9,71.98 48.77,72.12 48.77,73.56 49.25,74.04 49.25,80.25 48.18,81.32 48.18,85.95 49.55,87.33 52.27,87.33 arc-90 52.5,87.09 52.5,87.06 arc90 52.74,86.82 53.09,86.82 arc90 53.32,87.06 53.32,87.09 arc-90 53.56,87.33 53.91,87.33 arc-90 54.14,87.09 54.14,87.06 arc90 54.38,86.82 54.72,86.82 arc90 54.96,87.06 54.96,87.09 arc-90 55.19,87.33 58.88,87.33 59.31,86.89 59.31,84.44 59.78,83.97 60.11,83.97 60.52,84.38 v60.62,84.29
EDP_AUX_C_P  (via drill 0.2)
  Top 0.152: J2.15 59.64,86.61 60,86.25 60,85.74 60.16,85.57 60.17,85.57 60.67,85.08 60.67,84.92 60.42,84.68 v60.23,84.68 | C27.1 65.79,59.98 65.28,59.47 65.28,59.04 64.91,58.67 | 64.91,58.67 55.69,58.67 51.16,63.21 51.16,68.22 49.53,69.85 49.53,70.41 48.49,71.45 48.49,71.98 v48.35,71.98 | R20.1 65.34,58.24 64.91,58.67
  Bottom 0.152: v48.35,71.98 48.49,72.12 48.49,73.67 48.97,74.16 48.97,80.14 47.9,81.2 47.9,86.07 49.44,87.61 52.27,87.61 55.19,87.61 58.99,87.61 59.59,87.01 59.59,84.56 59.89,84.25 59.99,84.25 60.33,84.58 v60.23,84.68
EDP_AUX_N
  Top 0.152: J1.96 64.5,64.82 64.61,64.71 64.61,63.87 65.08,63.41 65.08,62.48 C28.2
EDP_AUX_P
  Top 0.152: J1.94 65,64.82 64.89,64.71 64.89,63.99 65.35,63.52 65.35,62.33 C27.2
EDP_HPD
  Top 0.152: J1.92 65.67,65.83 65.67,64.31 67.22,62.76 99.82,62.76 U1.4
ENET_LED0  (via drill 0.2)
  Top 0.206: J1.194 v38,67.61
  Bottom 0.206: v38,67.61 45.82,59.79 45.82,19.53 49.2,16.15 49.2,9.02 46.22,6.03 J3.14
ENET_LED1  (via drill 0.2)
  Top 0.206: v39.5,67.56 J1.188
  Bottom 0.206: J3.12 37.88,3.05 52.15,3.05 56.13,7.04 56.13,11.86 46.79,21.21 46.79,59.69 42.8,63.67 42.8,64.26 v39.5,67.56
ENET_TRD0_N
  Top 0.152: J1.202 36,64.82 35.89,64.71 35.89,45.9 arc90 36,45.79 36.02,45.79 arc-90 36.13,45.68 36.13,44.75 arc-90 36.02,44.64 arc90 35.89,44.51 35.89,42.78 arc90 36.12,42.54 arc-90 36.37,42.3 arc-90 36.12,42.05 arc90 35.89,41.82 35.89,41.8 arc90 36.12,41.56 arc-90 36.36,41.33 36.36,41.31 arc-90 36.12,41.07 arc90 35.89,40.84 35.89,40.82 arc90 36.12,40.58 arc-90 36.36,40.35 36.36,40.33 arc-90 36.12,40.09 arc90 35.89,39.86 35.89,39.84 arc90 36.12,39.6 arc-90 36.36,39.37 36.36,39.35 arc-90 36.12,39.11 arc90 35.89,38.88 35.89,38.86 arc90 36.12,38.62 arc-90 36.36,38.39 36.36,38.37 arc-90 36.12,38.13 arc90 35.89,37.9 35.89,19.07 J3.3
ENET_TRD0_P
  Top 0.152: J1.204 35.5,64.82 35.61,64.71 35.61,45.92 35.61,44.36 35.61,42.78 35.61,37.9 35.61,20.73 34.54,19.66 J3.2
ENET_TRD1_N  (via drill 0.3 pad 0.55)
  Top 0.152: J1.196 37.5,64.82 37.39,64.71 37.39,48.41 arc90 37.47,48.33 arc-90 37.68,48.12 37.68,47.33 arc-90 37.52,47.17 arc90 37.39,47.04 37.39,21.18 v38,20.57
  Bottom 0.152: v38,20.57 39.31,20.57 J3.7
ENET_TRD1_P
  Top 0.152: J1.198 37,64.82 37.11,64.71 37.11,48.52 37.11,46.94 37.11,16.48 J3.4
ENET_TRD2_N
  Top 0.152: J1.190 39,64.82 38.89,64.71 38.89,37.69 38.89,32.78 38.89,19.96 39.62,19.23 J3.6
ENET_TRD2_P
  Top 0.152: J1.192 38.5,64.82 38.61,64.71 38.61,37.69 arc-90 38.38,37.46 arc90 38.14,37.22 38.14,37.2 arc90 38.38,36.97 arc-90 38.61,36.73 38.61,36.71 arc-90 38.38,36.47 arc90 38.14,36.24 38.14,36.21 arc90 38.38,35.98 arc-90 38.61,35.74 38.61,35.72 arc-90 38.38,35.48 arc90 38.14,35.25 38.14,35.23 arc90 38.38,34.99 arc-90 38.61,34.76 38.61,34.73 arc-90 38.38,34.5 arc90 38.14,34.26 38.14,34.24 arc90 38.38,34 arc-90 38.61,33.77 38.61,33.75 arc-90 38.38,33.51 arc90 38.14,33.28 38.14,33.25 arc90 38.38,33.02 arc-90 38.61,32.78 38.61,19.25 J3.5
ENET_TRD3_N  (via drill 0.2)
  Top 0.152: J1.186 40,64.82 40.11,64.71 40.11,45.52 arc-90 39.88,45.28 39.86,45.28 arc90 39.62,45.05 39.62,44.63 arc90 39.86,44.4 39.88,44.4 arc-90 40.11,44.16 40.11,43.75 arc-90 39.88,43.52 39.86,43.52 arc90 39.62,43.28 39.62,42.87 arc90 39.86,42.64 39.88,42.64 arc-90 40.11,42.4 40.11,41.99 arc-90 39.88,41.76 39.86,41.76 arc90 39.62,41.52 39.62,41.11 arc90 39.86,40.87 39.88,40.87 arc-90 40.11,40.64 40.11,40.23 arc-90 39.88,39.99 39.86,39.99 arc90 39.62,39.76 39.62,39.35 arc90 39.86,39.11 39.88,39.11 arc-90 40.11,38.88 40.11,35.87 arc-90 39.88,35.63 39.76,35.63 arc90 39.52,35.4 39.52,34.77 arc90 39.76,34.54 39.88,34.54 arc-90 40.11,34.3 40.11,24.54 42.22,22.43 42.22,22.1 42.2,22.07 v42.08,22.07 | v41.13,22.05 41,21.91 41,21.26 43.26,18.99 J3.9
  Bottom 0.152: v42.08,22.07 42.22,21.94 42.22,21.77 41.87,21.41 41.3,21.41 41,21.72 41,22.05 v41.13,22.05
ENET_TRD3_P  (via drill 0.2)
  Top 0.152: J1.184 40.5,64.82 40.39,64.71 40.39,45.52 40.39,38.88 40.39,35.87 40.39,34.3 40.39,24.66 42.5,22.55 42.5,22.1 42.52,22.07 v42.64,22.07 | v40.58,22.05 40.72,21.91 40.72,21.14 42.03,19.83 | 42.03,19.83 42.09,19.77 | 42.03,19.83 42.16,19.7 J3.8
  Bottom 0.152: v42.64,22.07 42.5,21.94 42.5,21.65 41.98,21.13 41.19,21.13 40.72,21.6 40.72,22.05 v40.58,22.05
GEN3_I2C_SCL  (via drill 0.2)
  Top 0.152: U4.9 87.03,24.22 56.87,54.38 v56.39,54.38 | v41,67.51 40.11,68.4 30.94,68.4 v30.07,67.54 | v28.32,67.59 28,67.27 J1.234
  Bottom 0.152: v30.07,67.54 28.37,67.54 v28.32,67.59 | v41,67.51 41,66.79 43.03,64.75 43.03,64.47 43.1,64.4 43.1,63.8 52.52,54.38 v56.39,54.38
GEN3_I2C_SCL_3V
  Top 0.152: U4.12 87.05,13.74 82.3,8.99 74.14,8.99 71.4,6.25 J14.4
GEN3_I2C_SDA  (via drill 0.2)
  Top 0.152: J1.232 28.5,67.13 29.62,68.25 30.39,68.25 30.82,68.68 40.22,68.68 40.93,67.97 41.25,67.97 41.83,67.39 43.58,67.39 v43.69,67.28 | v55.14,55.19 57.05,55.19 87.68,24.56 U4.8
  Bottom 0.152: v43.69,67.28 44.45,66.52 44.45,64.2 53.02,55.63 54.71,55.63 v55.14,55.19
GEN3_I2C_SDA_3V
  Top 0.152: J14.3 73.94,6.93 75.23,8.23 82.91,8.23 87.7,13.02 U4.13
GND  (via drill 0.2, 0.3, 0.3 pad 0.55)
  Top 0.152: v12.6,52.25 12.51,52.34 12.51,52.91 | 12.51,52.91 C3.1 12.51,53.76 v12.6,53.85 | v13.34,53.06 13.18,52.91 12.51,52.91 | 13.23,58.67 C4.- | v7.59,66.27 8.1,66.78 JP1.1 | 5.44,55.85 5.44,56.29 | 5.44,56.29 5.44,56.41 | 5.44,56.41 C5.- 5.48,56.56 | 5.26,56.11 5.44,56.29 | 5.44,56.41 5.5,56.35 5.49,56.34 | 5.6,56.44 5.48,56.56 | 5.68,56.56 5.48,56.56 | J6.4 8.2,89.12 v8.2,89.69 | J5.4 29.46,89.09 v29.46,89.79 | J5.SHELL1 24.28,91.09 v24.28,90.6 | J5.SHELL3 24.33,97.19 v24.33,96.67 | J6.SHELL2 19.53,96.67 v20.83,96.67 | J6.SHELL 19.53,90.63 v20.85,90.63 | J6.SHELL1 4.28,90.53 v3.02,90.53 | J6.SHELL3 4.28,96.8 v2.95,96.8 | J5.SHELL 40.84,91.64 v42.09,91.64 | J5.SHELL2 40.84,97.77 v42.16,97.77 | v67.26,73.05 v67.25,73.06 J1.85 | 68.75,74.24 J1.79 | 71.75,74.32 J1.67 | J1.141 53.25,73.11 v53.24,73.1 | J1.135 54.75,73.11 v54.76,73.1 | J1.129 v56.25,73.14 v56.26,73.13 | J1.125 57.25,73.18 v57.17,73.1 | J1.119 v58.75,73.1 | v58.75,73.1 | J1.113 v60.25,73.03 | J1.107 v61.75,73 | J1.102 63,64.86 v63.02,64.85 | J1.86 v67,64.88 v67,64.87 | J1.80 v68.5,64.88 v68.5,64.87 | J1.74 v70,64.85 | J1.68 v71.5,64.87 | J1.62 v73,64.87 | v73,64.87 | J1.56 v74.5,64.87 | J1.50 76,64.89 v76.02,64.87 | J1.44 v77.5,64.88 v77.5,64.87 | J1.38 v79,64.9 v78.99,64.9 | J1.32 80.5,64.89 v80.52,64.87 | J1.26 82,64.89 v82.02,64.87 | J1.20 83.5,64.89 v83.52,64.87 | J1.14 85,64.91 v85.01,64.9 | J1.8 86.5,64.88 v86.51,64.87 | R18.1 105.14,78.53 Q3.2 105.44,80.62 v105.99,80.62 | IC3.2 v103.07,71.96 | v98.63,67.64 98.67,67.6 C26.1 | v97.92,66.88 97.94,66.9 C26.1 | v100.36,69.44 100.88,69.44 C7.1 100.82,68.86 v100.36,68.86 | v105.89,71.07 105.75,70.93 C6.2 105.13,70.95 v105.13,71.7
  Top 0.152: v102.97,94.28 102.46,94.79 C32.1 102.41,94.79 v102.97,95.35 | v103,96.27 102.51,96.75 C31.1 102.39,96.75 v103,97.36 | v4.6,8.53 S4.3 | S4.4 v4.6,14.62 v4.6,14.63 | v4.57,18.57 4.57,19.64 4.55,19.66 | v4.62,24.69 4.62,23.73 S2.4 | v68.33,85.62 67.6,85.62 R19.2 | R22.1 68.25,82.6 v68.4,82.45 | R23.1 68.35,81.18 v68.43,81.25 | C26.1 98.58,66.81 U1.1 | v97.48,63.42 97.66,63.6 U1.3 | v67.13,59.13 67.14,59.12 R20.2 v68,58.09 | v19.3,81.74 19.3,81.2 JP2.1 19.96,81.1 v19.96,81.76 | J1.264 21.44,57.73 v22.5,57.73 | v15.11,45.36 v15.1,45.35 14.4,45.35 | 14.4,45.35 C2.1 | v14.38,46.1 14.4,46.08 14.4,45.52 | 14.4,45.52 14.4,45.35 | v13.59,45.57 14.35,45.57 14.4,45.52 | J1.176 42.5,64.09 v42.37,63.96 | v94.82,12.09 94.07,12.09 C35.2 94.17,12.7 v94.82,12.7 | v85.93,14.96 86.12,14.96 U4.11 86.11,14.4 v85.9,14.4 | v94.97,22.89 94.14,22.89 C33.1 94.25,23.44 v94.97,23.44 | v54,64.87
  Top 0.203: v81.1,75.69 80.75,75.34 J1.31
  Top 0.305: Q1.2 14.12,13.65 v14.17,13.59 | J4.GND 4.74,67.84 v5.84,67.84 5.87,67.82 v6.38,67.82 | J4.GND 5.23,67.31 v5.23,67.26 v5.23,66.67 v5.82,66.67 | J4.GND 5.25,67.83 v5.82,67.26 v5.82,66.67 | v24.31,75.34 24.31,74.26 J1.249 24.25,73.08 v24.28,73.05 | v24.92,75.36 24.75,75.19 J1.247 24.75,73.19 v24.89,73.05 | v25.53,75.36 25.25,75.08 J1.245 25.25,73.28 v25.5,73.03 | v25.88,67.69 25.73,67.54 v25.73,67.08 26,66.81 J1.242 | J1.244 25.5,66.78 v25.17,67.11 | J1.246 25,66.69 v24.59,67.11 | J1.248 24.5,67.07 24.46,67.11 v24.03,67.11 24,67.08 J1.250 | J2.19 v61.64,84.97 v61.65,84.96 | IC2.2 57.67,84.85 v57.66,84.86 | IC2.5 56.17,84.82 v56.19,84.84 | IC2.8 54.67,84.82 v54.66,84.84 | IC2.11 53.17,84.83 v53.16,84.84 | J1.200 v36.5,67.18 | v36.5,67.18 | J1.170 v44,64.88 v43.99,64.87 | J1.164 v45.5,64.86 v45.49,64.85 | J1.158 47,64.88 v46.99,64.87 | J1.152 48.5,64.89 v48.51,64.87 | J1.146 50,64.88 v50.01,64.87 | J1.37 v79.25,72.98 v79.25,72.97 | J1.43 77.75,72.97 v77.78,72.95 | J1.49 76.25,72.72 v76.38,72.59 | J1.55 74.75,72.72 v74.6,72.57 | J1.61 73.25,75.71 v73.43,75.89 | J1.73 70.25,72.9 v70.38,72.77 | v71.6,75.84 71.75,75.7 71.75,74.32 | 68.75,74.24 68.75,72.92 v68.61,72.77 | J1.25 v82.25,75.34 | v83.74,75.36 v83.75,75.36 J1.19 | v85.24,75.34 85.25,75.33 J1.13 | v86.74,75.34 86.75,75.33 J1.7 | v88.75,74.24 88.7,74.2 J1.1 | J1.2 88.38,66 v88.49,65.89 | v95.66,86.74 95.64,86.73 U2.4 v96.26,86.74 v96.27,86.74 | v98.17,80.54 98.12,80.49 C9.1 | v85.72,81.05 86.45,81.05 C8.2 | v70.87,85.85 70.63,85.61 FB3.2 | v69.39,85.85 69.91,85.85 FB3.2 | v69.39,85.14 69.68,85.14 70.07,85.53 | 70.07,85.53 FB3.2 | v70.13,84.81 70.07,84.87 70.07,85.53
  Top 0.305: v70.87,85.09 70.43,85.53 70.07,85.53 | J1.177 v42.25,75.25 v42.24,75.26 | J1.147 49.75,75.24 v49.73,75.26 | v28.75,75.26 J1.231 | v32.26,75.26 J1.217 | v36.25,75.26 J1.201 | v43.74,75.26 43.75,75.25 J1.171 | v45.24,75.26 45.25,75.25 J1.165 | v48.23,75.26 48.25,75.25 J1.153 | v46.74,75.26 46.75,75.25 J1.159 | J1.132 v55.5,64.92 | J1.138 v54,64.87 | J1.144 v52.5,64.87 | v48.97,83.92 49.47,83.92 FB2.2 | v49,83.16 49.19,83.16 FB2.2 | v49.78,82.88 49.71,82.96 FB2.2 | v50.47,83.21 50,83.68 49.94,83.68 | 49.94,83.68 FB2.2 | v50.44,83.95 50.2,83.95 49.94,83.68 | v6.38,67.82 6.4,67.79 v6.91,67.79 v6.91,67.23 6.93,67.21 v6.93,66.67 v6.38,66.67 | v6.38,67.82 6.38,67.26 v6.35,67.23 6.38,67.21 v6.38,66.67 | v6.38,66.67 v5.82,66.67 | S2.3 4.55,19.66 S2.4 | S4.3 S4.4 | IC1.8 77.54,83.73 v77.55,83.74 | IC1.5 v79.04,83.73 v79.05,83.74 | IC1.11 76.04,83.73 v76.02,83.74 | IC1.2 v80.54,83.74 | J1.243 25.75,74.97 v26.14,75.36 26.14,74.31 J1.241 26.16,74.11 v26.16,73.03 25.75,73.44 J1.243
  Top 0.508: 6.06,41.9 v5.94,41.78 | v5.94,41.78 5.92,41.76 v5.23,41.76 5.23,41.07 | v5.21,41.05 5.23,41.07 | 5.23,41.07 v5.94,41.07 v6.68,41.07 v6.68,41.76 6.66,41.78 v5.94,41.78 | v14.05,23.8 12.99,23.8 | 12.99,23.8 Q2.2 13.14,23.83 v14.02,24.71 | v13.01,24.84 12.99,24.83 12.99,23.8 | v23.88,17.83 24.78,17.83 | 24.78,17.83 C1.1 | v24.92,16.15 24.92,15.37 | 24.92,15.37 FB1.2 | v24.92,16.87 24.78,17.01 24.78,17.83 | v23.88,15.37 24.92,15.37 | C31.1 102.04,96.83 v103,96.83 | v103,96.83 v103,97.36 | v103,96.83 v103,96.27 | C32.1 101.94,94.82 v102.97,94.82 | v102.97,94.82 v102.97,95.35 | v102.97,94.82 v102.97,94.28 | J1.263 89.14,57.63 v90.04,57.63 | v40.66,85.57 40.84,85.57 40.84,84.82 C30.1 41.1,84.72 41.1,85.45 v41.22,85.57 | v42.52,85.6 42.65,85.47 42.65,84.82 C29.1 42.95,84.77 42.95,85.47 v43.08,85.6
  Top 1.27: C4.- 13.26,58.94 v13.26,56.34 v13.95,56.34 v13.95,57 v13.26,57 v12.6,57 v12.6,56.34 12.6,53.15 C3.1 | C5.- 5.44,54.13 v5.36,54.05 | v6.12,54.81 v6.12,54.05 v5.36,54.05 | v4.6,54.05 v4.6,54.81 v5.36,54.81 v5.36,54.05 | U3.1 6.06,41.9 5.92,41.76 | C34.- 13.18,32.83 v13.18,30.3 | v13.18,30.3 v12.47,30.3 | v12.5,31.01 12.52,30.99 v13.18,30.99 13.87,30.99 v13.89,30.96 | v13.18,30.3 13.87,30.3 v13.89,30.28
  other vias: 53.14,86.33 54.66,86.36 56.16,86.33 57.66,86.28 19.63,56.18 19.66,57.25 19.61,58.37 19.63,59.31 19.68,60.07 22.48,60.1 22.48,59.39 22.53,58.55 22.48,56.97 22.53,56.13 24.08,64.69 24.69,64.74 25.37,64.74 20.85,91.82 20.83,97.84 24.31,97.84 24.33,91.69 3,91.74 2.92,97.84 42.16,90.55 42.19,96.67 87.3,60.07 88.47,60.07 89.97,60.1 90.04,58.98 90.04,56.44 89.1,56.13 87.99,56.13 87.35,57.15 87.22,58.62 65.99,72.85 64.29,72.85 64.29,75.64 65.99,75.64 56.92,71.42 50.85,76.99 52.58,76.89 32.87,77.88 34.72,77.88 33.55,84.15 35.26,84.15 78.28,75.72 78.31,77.01 75.64,76.81 76.43,75.69 81.13,77.06 61.65,72.21 62.94,71.37 55.09,77.5 53.82,76.3 41.61,22.35 43.13,22.4 40.11,22.35
  pour Route2: -5.94,-5.21 113.13,-5.21 113.13,103.35 -5.94,103.35
  pour Top: 23.93,67.67 26.11,67.67 26.11,64.39 23.93,64.39
  pour Top (rank 2): -2.46,102.01 113.97,102.01 113.97,-4.01 -2.46,-4.01
  pour Bottom: -3.71,103.28 115.95,103.28 115.95,-5.84 -3.71,-5.84
HDMI_5V_DIODE
  Top 0.305: CN1.18 82,93.51 83.49,95 90.79,95 D1.C
HDMI_HPD
  Top 0.152: Q3.3 104.19,83.52 | 104.19,83.52 107.14,83.52 R5.1 | J1.88 66.5,63.88 67.26,63.12 87.88,63.12 93.55,68.78 93.55,70.94 100.74,78.13 100.74,81.56 102.7,83.52 104.19,83.52
HDMI_HPD_IN  (via drill 0.2)
  Top 0.152: CN1.19 82.59,90.91 v83.03,90.91 | v101.55,81.15 101.78,80.92 Q3.1 103.04,80.82 R18.2
  Bottom 0.152: v83.03,90.91 84.99,88.95 86.61,88.95 87.3,89.64 87.3,92.73 87.94,93.37 99.54,93.37 101.55,91.36 v101.55,81.15
HDMI_PWR  (via drill 0.2)
  Top 0.152: C8.1 89.68,81.03 89.73,80.97
  Top 0.305: IC1.13 76.18,80.39 v76.07,80.39 | v79.86,80.19 79.79,80.26 IC1.15 | v88.59,79.25 88.67,79.32 FB6.2 89.73,80.97 89.73,81.8 U2.8 91,82.31 92.84,84.15 92.84,90.68 92.06,91.45 R7.2
  Top 0.508: D1.A 96.25,94.65 94.51,92.91 92.62,92.91 R7.2 R8.2 | C32.2 97.22,94.79 D1.A | C31.2 97.24,96.75 D1.A
  Bottom 0.305: v76.07,80.39 79.65,80.39 v79.86,80.19 80.62,79.43 80.62,78.46 87.81,78.46 v88.59,79.25
HDMI_SCL  (via drill 0.2)
  Top 0.152: J1.100 63.5,67.61 64.29,68.4 81.05,68.4 82.09,68.4 91.01,68.4 92.33,69.72 92.33,71.04 99.67,78.38 99.67,81.92 98,83.58 97.13,83.58 | 97.13,83.58 U2.2 | 97.13,83.58 97.41,83.3 v97.41,82.78 | v98.7,89.74 99.35,90.38 R4.2
  Bottom 0.152: v97.41,82.78 97.41,88.44 v98.7,89.74
HDMI_SCL_5V  (via drill 0.2)
  Top 0.152: U2.7 v88.54,83.58 87.13,83.58 81.64,89.08 81.11,89.08 80.5,89.69 CN1.15 | R8.1 89.03,87.1 v88.52,86.59
  Bottom 0.152: v88.52,86.59 88.52,83.61 v88.54,83.58
HDMI_SDA
  Top 0.152: J1.98 64,67.56 64.44,68 81.76,68 91.64,68 92.96,69.32 92.96,71.02 100.25,78.31 100.25,82.65 98.05,84.85 97.05,84.85 97.03,84.85 | 97.03,84.85 U2.3 | R6.2 96.52,90.92 96.52,88.37 97.03,87.86 97.03,84.85
HDMI_SDA_5V
  Top 0.152: R7.1 92,88.81 92,85.67 91.18,84.85 U2.6 86.39,84.85 81.89,89.36 81.23,89.36 81,89.59 CN1.16
HDMI_SHIELD
  Top 0.305: CN1.2 74,93.5 | 74,93.5 72.47,93.5 72.47,90.37 70.16,88.06 FB3.1 | 74,93.5 75.5,93.5 | 75.5,93.5 CN1.5 | 75.5,93.5 77,93.5 | 77,93.5 CN1.8 | 77,93.5 78.5,93.5 | 78.5,93.5 CN1.11 | 78.5,93.5 81.5,93.5 CN1.17
N$1
  Top 0.152: R1.2 29.89,8.49 J3.11
N$2
  Top 0.152: J3.13 44.59,7.54 51.63,7.54 R2.2
N$3
  Top 0.152: C1.2 32.62,19.65 J3.1
N$4
  Top 0.508: FB1.1 31,13.35 J3.MH1 J3.MH2
N$6
  Top 0.152: LED2.C 9.21,23.89 Q2.3
N$7
  Top 1.016: J5.1 36.71,88.38 38.99,86.1 FB5.2
N$8
  Top 1.016: J6.1 17.56,86.96 FB4.2
N$9
  Top 0.152: R3.1 8,21.22 LED2.A
N$12
  Top 0.152: J4.ID 7.24,68.48 JP1.2
N$13
  Top 0.152: Q1.3 8.72,14.23 LED1.C
N$14
  Top 0.152: LED1.A 8.65,11.26 R17.1
N$20  (via drill 0.35)
  Top 0.305: v62.13,90.42 62.15,90.4 62.15,88.13 J2.20
  Top 0.508: D2.C v45.77,86.94
  Bottom 0.508: v45.77,86.94 45.77,91.69 47.3,93.22 59.33,93.22 v62.13,90.42
PWR_EN
  Top 0.305: JP2.2 22.45,80.01 23.47,81.03 23.47,81.48 | 23.47,81.48 J10.1 | J1.237 27.25,77.12 23.47,80.9 23.47,81.48
TMDS_CLK_C1_N
  Top 0.152: C16.2 81.92,79.45 81.92,80.25 81.68,80.49 81.67,80.49 81.61,80.54 81.45,80.54 80.59,81.4 80.59,81.68 80.75,81.84 81.23,81.84 81.31,81.92 81.31,82.14 81.04,82.41 IC1.1 81.04,83.83 81.28,84.07 82.07,84.07 82.3,84.3 82.3,84.74 R10.1
TMDS_CLK_C1_P  (via drill 0.2)
  Top 0.152: C17.2 82.8,79.52 v82.32,80.01 | v81.51,80.09 80.29,81.31 80.29,81.84 80.03,82.09 IC1.3 80.04,83.85 80.54,84.35 81.38,84.35 81.53,84.51 81.53,84.94 R9.1
  Bottom 0.152: v82.32,80.01 81.59,80.01 v81.51,80.09
TMDS_CLK_C_N
  Top 0.152: R10.2 81.94,87.02 81.94,87.34 81.86,87.42 arc-90 81.86,87.75 arc90 81.86,87.91 81.22,88.54 arc90 81.07,88.54 arc-90 80.74,88.54 79.97,89.31 79.17,89.31 79,89.48 CN1.12
TMDS_CLK_C_P
  Top 0.152: R9.2 81.66,86.58 81.66,87.22 80.54,88.35 79.86,89.03 78.69,89.03 78,89.72 CN1.10
TMDS_CLK_N  (via drill 0.2)
  Top 0.152: J1.47 76.75,75.38 76.86,75.49 76.86,75.81 77.58,76.53 77.83,76.53 v77.83,76.68 | v80.72,76.68 80.87,76.53 81.92,76.53 82.02,76.63 82.02,77.32 C16.1
  Bottom 0.152: v77.83,76.68 77.97,76.53 80.57,76.53 v80.72,76.68
TMDS_CLK_P  (via drill 0.2)
  Top 0.152: J1.45 77.25,75.38 77.14,75.49 77.14,75.69 77.7,76.25 77.83,76.25 v77.83,76.1 | v80.72,76.1 80.87,76.25 82.03,76.25 82.3,76.52 82.3,77.35 C17.1
  Bottom 0.152: v77.83,76.1 77.97,76.25 80.57,76.25 v80.72,76.1
TMDS_D0_C1_N
  Top 0.152: C14.2 79.4,79.78 79.4,82.01 79.49,82.1 79.49,82.8 IC1.4 79.48,82.9 79.48,84.44 80.11,85.07 R12.1
TMDS_D0_C1_P
  Top 0.152: C15.2 79.12,79.3 79.12,81.54 78.61,82.05 78.61,82.78 IC1.6 78.59,82.9 78.59,83.94 79.09,84.45 79.09,84.71 78.72,85.09 R11.1
TMDS_D0_C_N
  Top 0.152: R12.2 79.7,86.64 79.7,87 77.47,89.23 77.47,90.97 CN1.9
TMDS_D0_C_P
  Top 0.152: R11.2 78.97,86.53 78.97,87.3 76.58,89.69 76.58,90.92 CN1.7
TMDS_D0_N
  Top 0.152: C14.1 80.16,77.56 79.52,76.92 79.52,75.72 79.33,75.53 79.23,75.53 78.75,75.05 J1.39
TMDS_D0_P
  Top 0.152: C15.1 78.84,77.47 79.24,77.08 79.24,75.94 79.11,75.81 79.01,75.81 78.25,75.05 J1.41
TMDS_D1_C1_N
  Top 0.152: C12.2 77.47,79.04 77.47,81.63 78.04,82.2 IC1.7 78.04,83.86 77.07,84.83 77.37,85.12 R14.1
TMDS_D1_C1_P
  Top 0.152: C13.2 77.19,80 77.19,81.79 77.11,81.87 77.11,82.77 IC1.9 77.11,82.92 77.11,84.1 76.45,84.76 R13.1
TMDS_D1_C_N
  Top 0.152: R14.2 77.42,86.31 75.72,88 75.72,89.28 76.02,89.59 76.02,90.98 CN1.6
TMDS_D1_C_P
  Top 0.152: R13.2 76.35,86.28 76.45,86.38 76.45,86.84 75.41,87.89 75.41,89.27 75,89.68 CN1.4
TMDS_D1_N
  Top 0.152: J1.53 75.25,75.38 75.36,75.49 75.36,75.73 76.49,76.86 77.11,76.86 77.5,77.24 C12.1
TMDS_D1_P  (via drill 0.2)
  Top 0.152: J1.51 75.75,75.38 75.64,75.49 75.64,75.61 76.36,76.34 v76.45,76.25 | v76.15,77.09 76.2,77.14 C13.1
  Bottom 0.152: v76.45,76.25 76.45,76.79 v76.15,77.09
TMDS_D2_C1_N
  Top 0.152: C10.2 74.41,79.52 74.41,79.94 76.54,82.07 IC1.10 76.54,83.88 76.23,84.18 75.48,84.18 74.78,84.89 R16.1
TMDS_D2_C1_P
  Top 0.152: C11.2 74.12,79.55 74.12,80.05 75.61,81.55 75.61,82.77 IC1.12 75.54,83.7 74.78,84.45 73.76,84.45 73.46,84.76 R15.1
TMDS_D2_C_N
  Top 0.152: CN1.3 74.5,89.51 74.14,89.15 74.14,86.92 R16.2
TMDS_D2_C_P
  Top 0.152: R15.2 73.82,86.64 73.86,86.64 73.86,89.18 73.5,89.54 CN1.1
TMDS_D2_N
  Top 0.152: C10.1 74.91,77.6 74.26,76.95 74.26,75.54 74.26,74.21 J1.57
TMDS_D2_P
  Top 0.152: C11.1 73.61,77.32 73.98,76.95 73.98,75.54 73.75,75.31 J1.59
UART1_RX  (via drill 0.2)
  Top 0.152: J1.238 27,67.06 27.38,67.43 27.38,69.44 27.71,69.77 41,69.77 v42.85,67.92 | v53.54,55.19 84.76,23.98 v84.76,23.7 | v90.96,21.95 90.96,20.85 U4.3
  Bottom 0.152: v42.85,67.92 43.28,67.48 43.28,67.12 43.59,66.81 43.59,64.7 43.66,64.63 43.66,64.03 52.5,55.19 v53.54,55.19 | v84.76,23.7 86.51,21.95 v90.96,21.95
UART1_RX_3V
  Top 0.152: U4.18 90.93,11.56 92.51,9.98 103.45,9.98 J13.3
UART1_TX  (via drill 0.2)
  Top 0.152: J1.236 27.5,67.16 27.66,67.32 27.66,69.01 27.91,69.27 40.59,69.27 41.99,67.87 v42.01,67.87 | v85.37,24.03 85.37,24.13 55.57,53.93 v54.66,54.84 | v92.25,22.02 92.25,20.84 U4.1
  Bottom 0.152: v42.01,67.87 42.05,67.91 42.06,66.12 43.31,64.87 43.31,64.59 43.38,64.52 43.38,63.92 52.56,54.74 54.56,54.74 v54.66,54.84 | v92.25,22.02 91.45,22.02 91.12,22.35 87.05,22.35 v85.37,24.03
UART1_TX_3V
  Top 0.152: U4.20 105.62,14.69 J13.2
USB0(OTG)_D_N  (via drill 0.2)
  Top 0.203: J1.109 61.25,72.92 61.16,72.83 61.16,71.45 61.39,71.22 61.82,71.22 62.08,71.48 62.08,71.75 v61.97,71.75
  Top 0.206: J4.D- 5.86,69.78 6.01,69.62 8.81,69.62 v8.99,69.44
  Bottom 0.203: v61.97,71.75 62.08,71.64 62.08,69.55 61.27,68.73 59.72,68.73
  Bottom 0.206: v8.99,69.44 9.69,68.73 26.52,68.73 arc90 26.78,68.99 26.78,69.11 arc-90 27.04,69.37 27.28,69.37 arc-90 27.54,69.11 27.54,68.99 arc90 27.8,68.73 28.05,68.73 arc90 28.31,68.99 28.31,69.11 arc-90 28.57,69.37 28.81,69.37 arc-90 29.07,69.11 29.07,68.99 arc90 29.33,68.73 59.72,68.73
USB0(OTG)_D_P  (via drill 0.2)
  Top 0.203: J1.111 60.75,72.92 60.84,72.83 60.84,71.31 61.26,70.89 61.96,70.89 62.41,71.34 62.41,71.75 v62.52,71.75
  Top 0.206: J4.D+ 5.86,69.13 6.01,69.28 8.29,69.28 v8.56,69.01
  Bottom 0.203: v62.52,71.75 62.41,71.64 62.41,69.41 61.4,68.4 60.25,68.4 59.73,68.4
  Bottom 0.206: v8.56,69.01 9.17,68.4 26.52,68.4 29.33,68.4 59.73,68.4
USB1_D_N  (via drill 0.2)
  Top 0.203: v34.68,84.15 34.68,85.09 33.35,86.42 33.35,88.23 J5.2
  Top 0.206: J1.115 59.75,72.69 57.01,69.95 52.19,69.95 50.77,71.36 50.77,75.95 49.81,76.91 41.54,76.91 35.33,76.91 34.38,76.91 33.75,77.54 33.75,77.57 33.63,77.69 33.63,77.73 v33.48,77.88
  Bottom 0.203: 33.62,78.01 33.62,81.36 32.08,82.91 32.08,84.21 32.96,85.09 34.07,85.09 34.57,84.59 34.57,84.15 v34.68,84.15
  Bottom 0.206: v33.48,77.88 33.62,78.01
USB1_D_P  (via drill 0.2)
  Top 0.203: v34.13,84.15 34.13,85.17 33.02,86.28 33.02,88.29 J5.3
  Top 0.206: J1.117 59.25,72.69 56.85,70.28 52.32,70.28 51.1,71.5 51.1,76.09 49.95,77.24 41.54,77.24 arc-90 41.28,77.51 41.28,77.52 arc90 41.02,77.78 40.73,77.78 arc90 40.47,77.52 40.47,77.51 arc-90 40.21,77.24 39.92,77.24 arc-90 39.66,77.51 39.66,77.52 arc90 39.39,77.78 39.1,77.78 arc90 38.84,77.52 38.84,77.51 arc-90 38.58,77.24 38.29,77.24 arc-90 38.03,77.51 38.03,77.52 arc90 37.77,77.78 37.48,77.78 arc90 37.22,77.52 37.22,77.51 arc-90 36.96,77.24 36.67,77.24 arc-90 36.41,77.51 36.41,77.52 arc90 36.14,77.78 35.85,77.78 arc90 35.59,77.52 35.59,77.51 arc-90 35.33,77.24 34.52,77.24 34.09,77.68 v34.09,77.88
  Bottom 0.203: 33.95,78.01 33.95,81.5 32.41,83.04 32.41,84.07 33.1,84.76 33.93,84.76 34.24,84.45 34.24,84.15 v34.13,84.15
  Bottom 0.206: v34.09,77.88 33.95,78.01
USB2_D_N  (via drill 0.2)
  Top 0.203: v10.55,80.21 10.44,80.32 10.44,83.03 12.09,84.68 12.09,88.3 J6.2
  Top 0.206: J1.121 58.2,74.15 58.2,72.86 57.45,72.12 57.05,72.12 v56.92,71.99
  Bottom 0.152: 17.73,72.13 18.15,71.7 44.35,71.7 45.34,70.71 52.24,70.71 53.68,72.16 56.65,72.16 56.66,72.15 56.76,72.15 56.79,72.13
  Bottom 0.203: 11.73,78.12 11.73,80.44 11.25,80.92 10.59,80.92 10.44,80.77 10.44,80.31 v10.54,80.21 v10.55,80.21
  Bottom 0.206: 56.79,72.13 v56.92,71.99 | 11.73,78.12 17.73,72.13
USB2_D_P  (via drill 0.2)
  Top 0.203: v10,80.21 10.11,80.32 10.11,83.17 11.76,84.82 11.76,88.26 J6.3
  Top 0.206: J1.123 57.83,74.12 57.83,72.99 57.3,72.47 57.05,72.47 v56.92,72.59
  Bottom 0.152: 17.86,72.46 18.34,71.98 44.46,71.98 45.45,70.99 52.12,70.99 53.57,72.44 56.77,72.44 56.79,72.46
  Bottom 0.203: 12.06,78.26 12.06,80.58 11.39,81.25 10.46,81.25 10.11,80.91 10.11,80.31 v10.01,80.21 v10,80.21
  Bottom 0.206: 56.79,72.46 v56.92,72.59 | 12.06,78.26 17.86,72.46
VDD
  Top 1.27: J1.255 17.25,74.2 PTC1.1 18.28,66 J1.256
  pour Top: 23.88,72.82 23.88,75.92 20.65,75.92 20.65,72.82
  pour Top: 23.67,64.64 23.67,67.56 21.03,67.56 21.03,64.64

## Text on the board
tPlace: 5V 5V GND GND | 3V 3V GND GND | RESET | RECOVERY | RX TX GND | SCL SDA GND 3v3 | GND AMCLK SCLK DOUT FS 3v3
tStop: DLT Jetson Nano Breakout rev. 1